# EAGLE design X15-Pi-Shield (EAGLE 9.6.2)

## Sheet 1 of 4
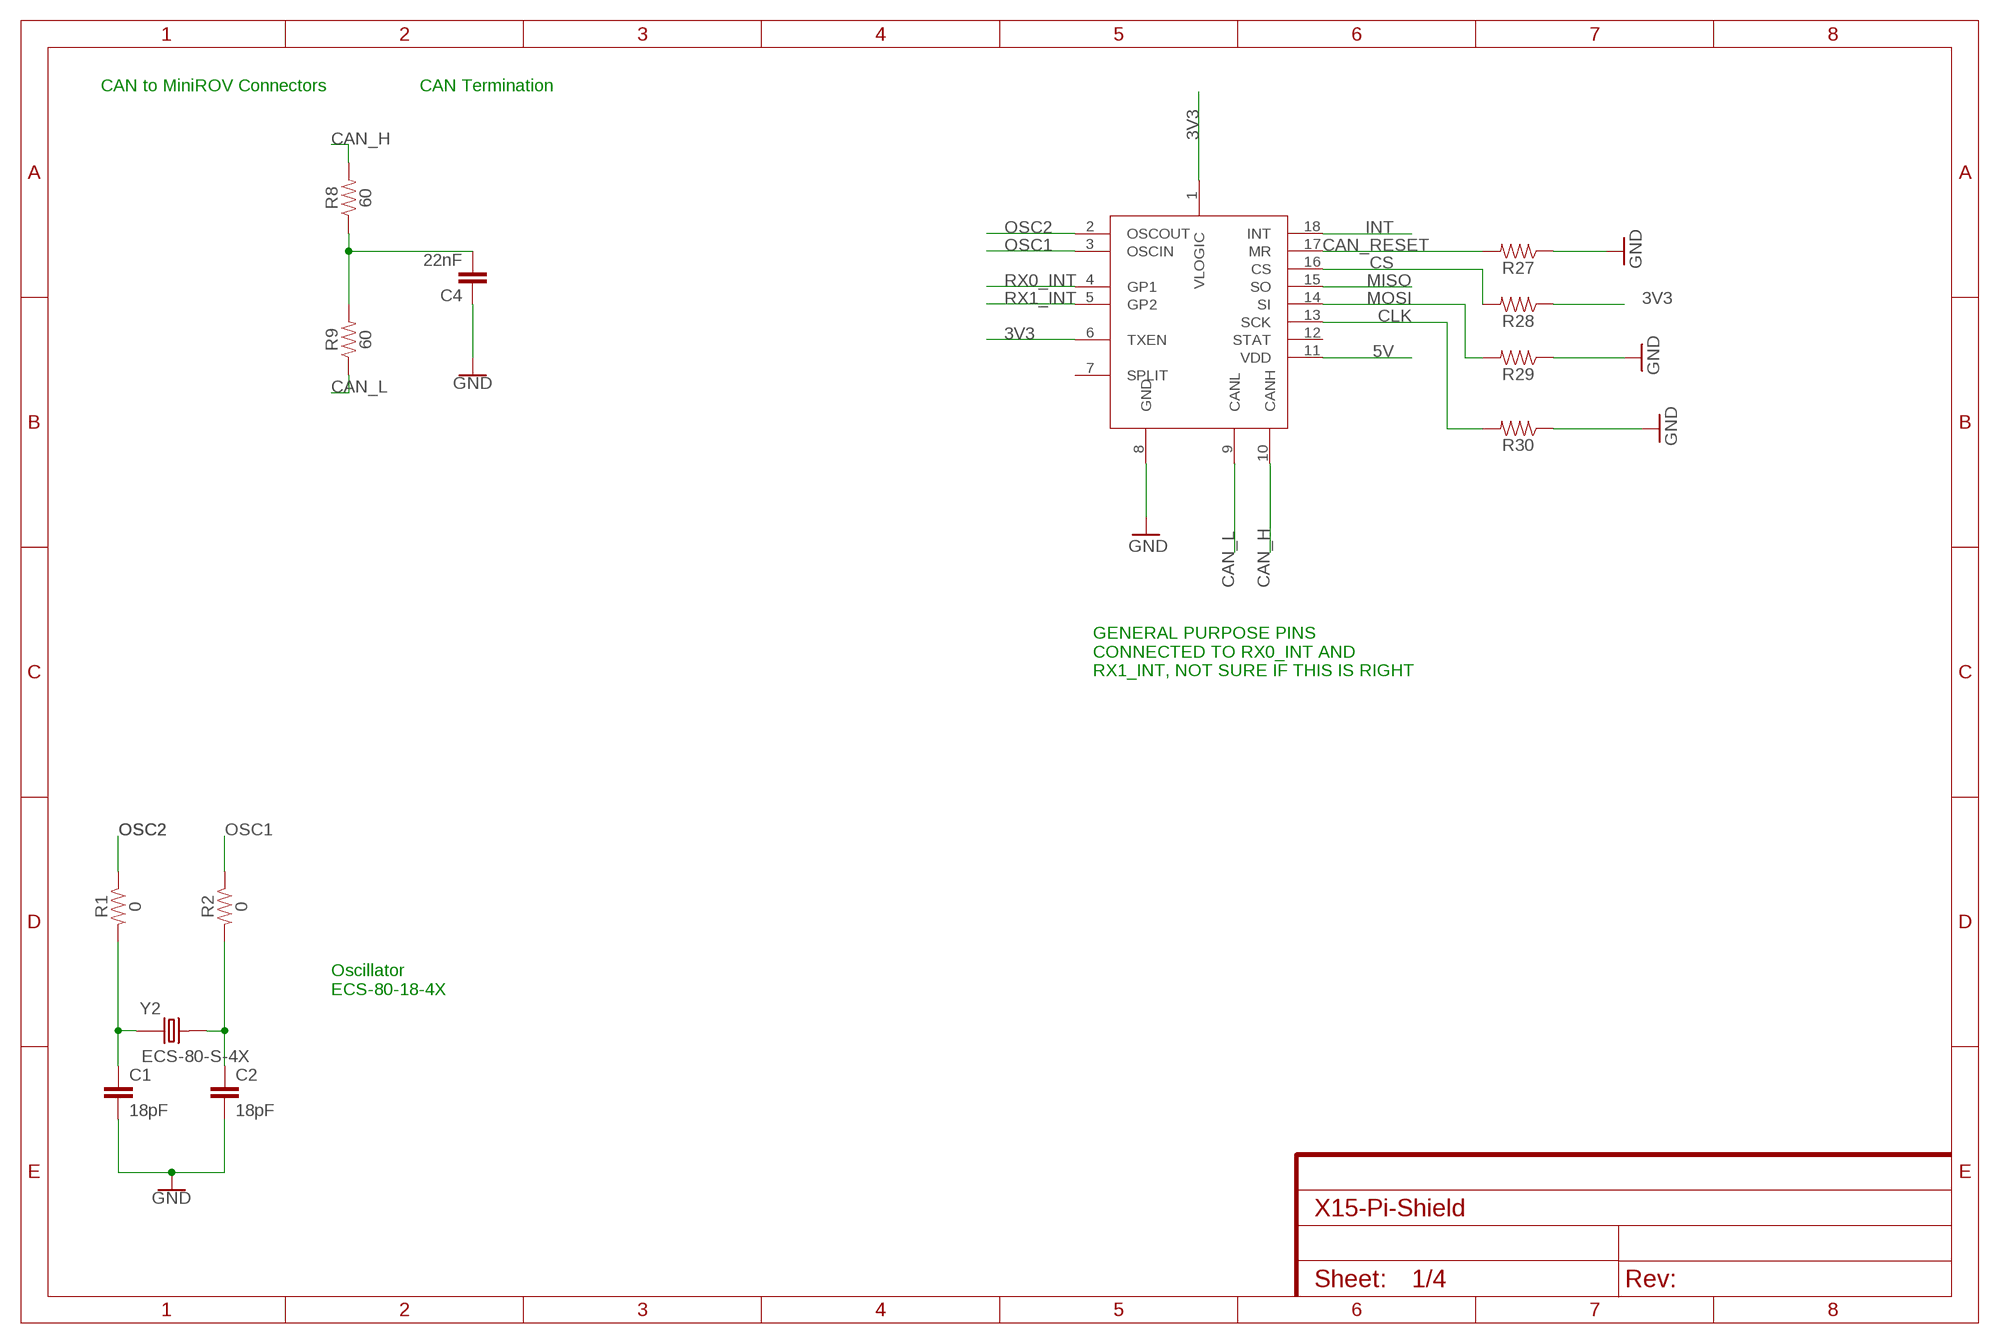
[diagram p0: schematic, sheet 1]

### Parts
C1  18pF  18PF-0603-50V-5%  [0603]
C2  18pF  18PF-0603-50V-5%  [0603]
C4  22nF  22NF/22,000PF-0603-50V-10%  [0603]
R1  0  RESISTOR0603  [0603]
R2  0  RESISTOR0603  [0603]
R8  60  RESISTOR0603  [0603]
R9  60  RESISTOR0603  [0603]
R27  50k  RESISTOR0603  [0603]
R28  50k  RESISTOR0603  [0603]
R29  50k  RESISTOR0603  [0603]
R30  50k  RESISTOR0603  [0603]
U$6  HI-3110  [SOIC-18]
Y2  ECS-80-S-4X  [XTAL_ECS-80-S-4X]

### Nets
3V3: R28.1 U$6.1(VLOGIC) U$6.6(TXEN) ; also sheet 2,3,4
5V: U$6.11(VDD) ; also sheet 2,3,4
CAN_H: R8.2 U$6.10(CANH) ; also sheet 2,4
CAN_L: R9.1 U$6.9(CANL) ; also sheet 2,4
CAN_RESET: R27.2 U$6.17(MR) ; also sheet 2
CLK: R30.2 U$6.13(SCK) ; also sheet 2
CS: R28.2 U$6.16(CS) ; also sheet 2
GND: C1.2 C2.2 C4.1 R27.1 R29.1 R30.1 U$6.8(GND) ; also sheet 2,3,4
INT: U$6.18(INT) ; also sheet 2
MISO: U$6.15(SO) ; also sheet 2
MOSI: R29.2 U$6.14(SI) ; also sheet 2
N$1: C1.1 R1.2 Y2.1
N$2: C2.1 R2.2 Y2.2
N$3: C4.2 R8.1 R9.2
OSC1: R2.1 U$6.3(OSCIN)
OSC2: R1.1 U$6.2(OSCOUT)
RX0_INT: U$6.4(GP1) ; also sheet 2
RX1_INT: U$6.5(GP2) ; also sheet 2
Unconnected: U$6.7(SPLIT) U$6.12(STAT)

### Notes on the sheet
- CAN to MiniROV Connectors | CAN Termination
- GENERAL PURPOSE PINS
  CONNECTED TO RX0_INT AND
  RX1_INT, NOT SURE IF THIS IS RIGHT
- Oscillator 
  ECS-80-18-4X

## Sheet 2 of 4
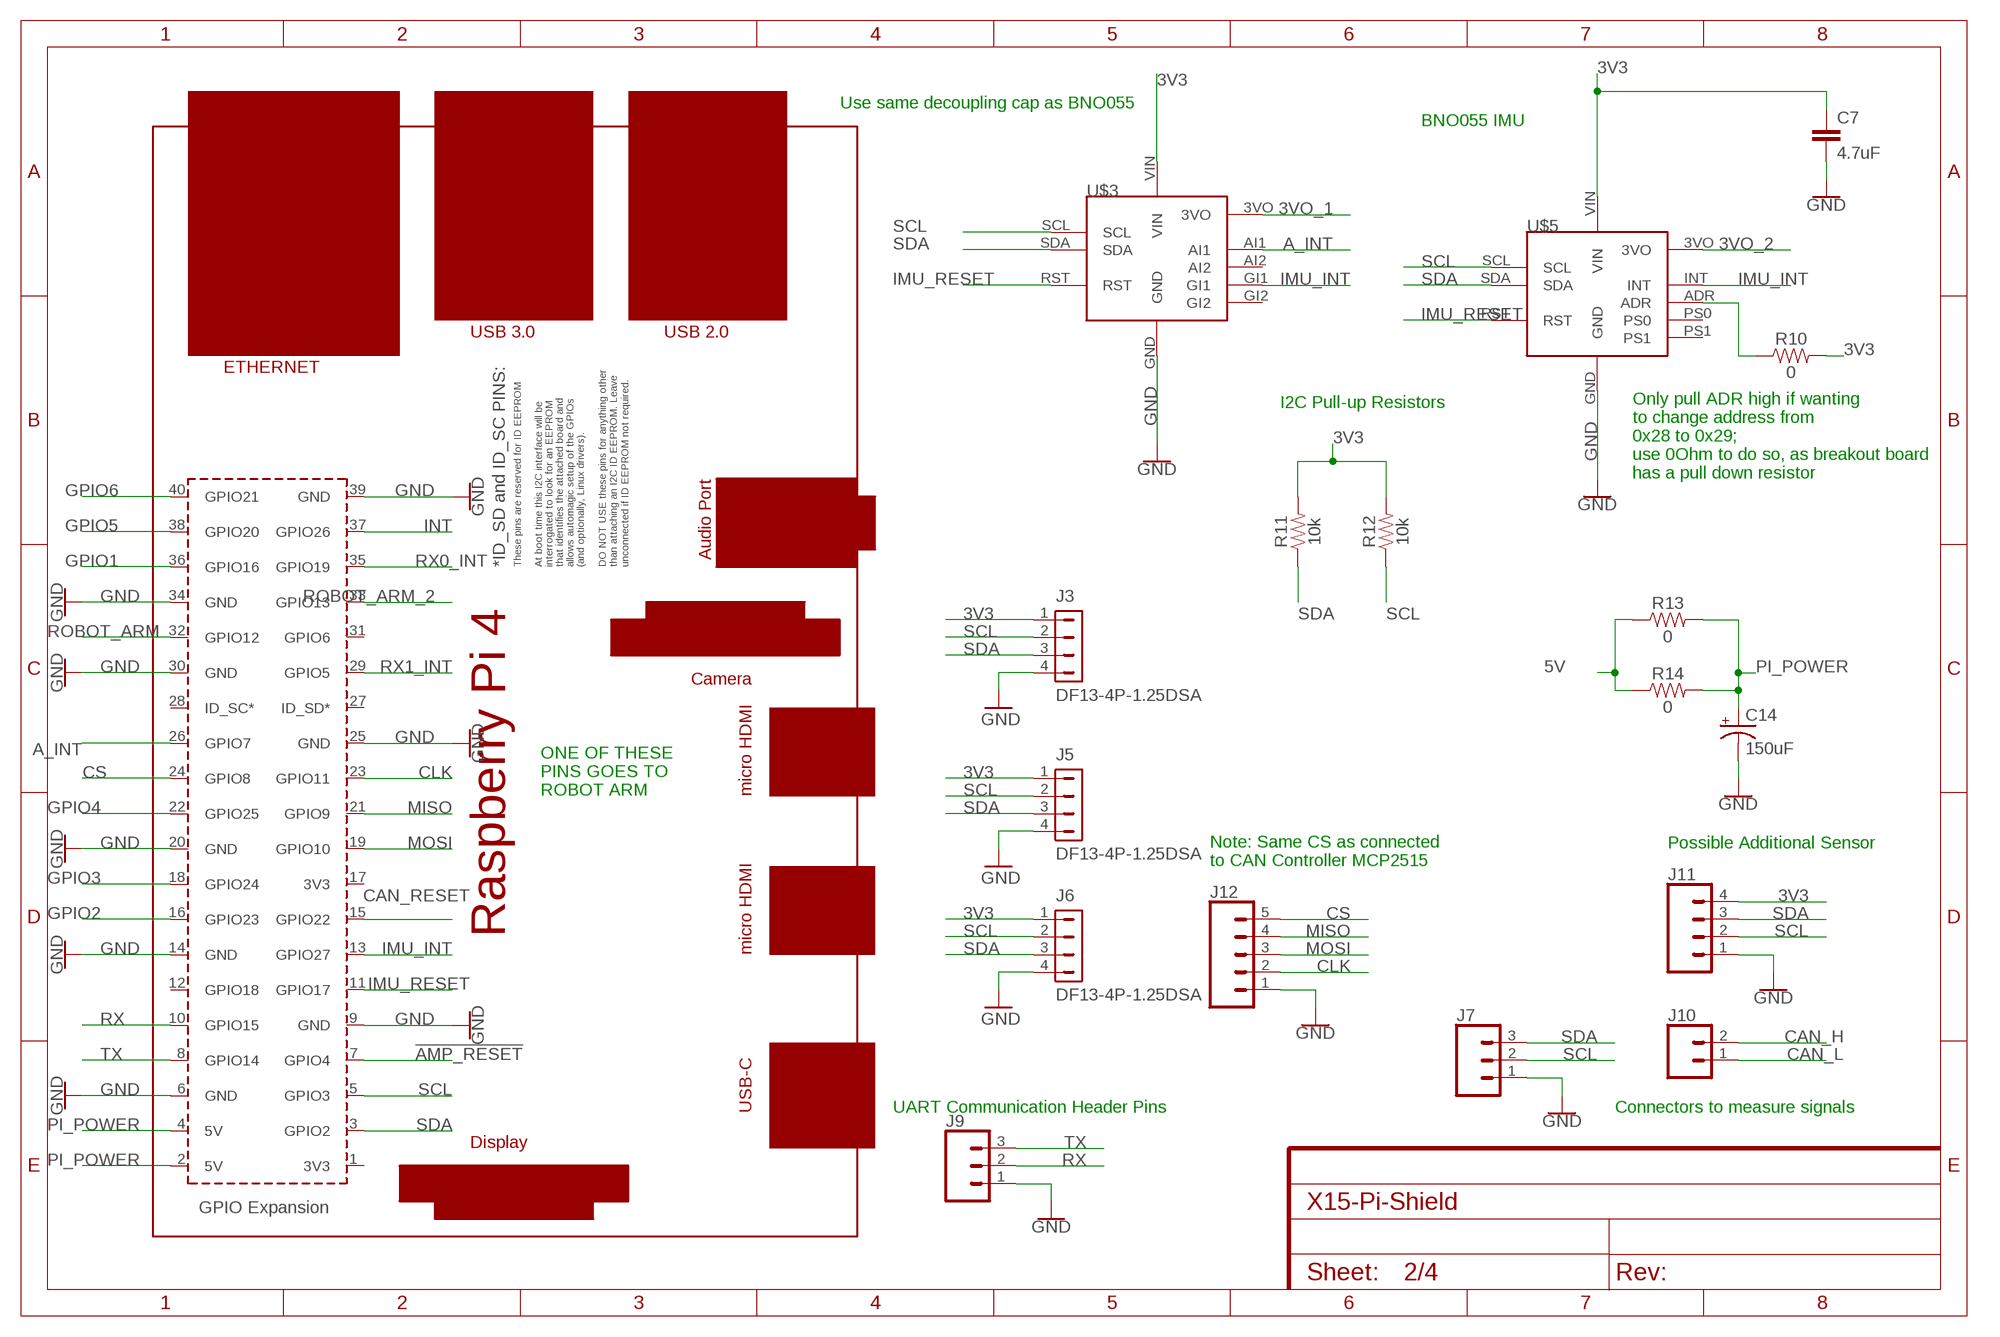
[diagram p1: schematic, sheet 2]

### Parts
C7  4.7uF  4.7UF0603  [0603]
C14  150uF  C-TANTALUM(10UF_150UF)  [2917(7343-31-METRIC)]
J3  DF13-4P-1.25DSA  [DF13-4P-1.25DSA]
J5  DF13-4P-1.25DSA  [DF13-4P-1.25DSA]
J6  DF13-4P-1.25DSA  [DF13-4P-1.25DSA]
J7  CONN_03  [1X03]
J9  CONN_03  [1X03]
J10  CONN_02  [1X02]
J11  CONN_04  [1X04]
J12  CONN_05  [1X05]
R10  0  RESISTOR0603  [0603]
R11  10k  RESISTOR0603  [0603]
R12  10k  RESISTOR0603  [0603]
R13  0  RESISTOR0603  [0603]
R14  0  RESISTOR0603  [0603]
U$3  ADAFRUIT-FXOS8700-FXAS21002  [ADAFRUIT-FXOS8700-FXAS21002]
U$4  RPI4  [RPI4]
U$5  ADAFRUIT-BNO055  [ADAFRUIT-BNO055]

### Nets
3V3: C7.1 J3.1 J5.1 J6.1 J11.4 R10.2 R11.2 R12.2 U$3.VIN U$5.VIN ; also sheet 1,3,4
3VO_1: U$3.3VO
3VO_2: U$5.3VO
5V: R13.1 R14.1 ; also sheet 1,3,4
!AMP_RESET: U$4.7(GPIO4) ; also sheet 3
A_INT: U$3.AI1 U$4.26(GPIO7)
CAN_H: J10.2 ; also sheet 1,4
CAN_L: J10.1 ; also sheet 1,4
CAN_RESET: U$4.15(GPIO22) ; also sheet 1
CLK: J12.2 U$4.23(GPIO11) ; also sheet 1
CS: J12.5 U$4.24(GPIO8) ; also sheet 1
GND: C7.2 C14.- J3.4 J5.4 J6.4 J7.1 J9.1 J11.1 J12.1 U$3.GND U$4.6(GND) U$4.9(GND) U$4.14(GND) U$4.20(GND) U$4.25(GND) U$4.30(GND) U$4.34(GND) U$4.39(GND) U$5.GND ; also sheet 1,3,4
GPIO1: U$4.36(GPIO16) ; also sheet 4
GPIO2: U$4.16(GPIO23) ; also sheet 4
GPIO3: U$4.18(GPIO24) ; also sheet 4
GPIO4: U$4.22(GPIO25) ; also sheet 4
GPIO5: U$4.38(GPIO20) ; also sheet 4
GPIO6: U$4.40(GPIO21) ; also sheet 4
IMU_INT: U$3.GI1 U$4.13(GPIO27) U$5.INT
IMU_RESET: U$3.RST U$4.11(GPIO17) U$5.RST
INT: U$4.37(GPIO26) ; also sheet 1
MISO: J12.4 U$4.21(GPIO9) ; also sheet 1
MOSI: J12.3 U$4.19(GPIO10) ; also sheet 1
N$8: R10.1 U$5.ADR
PI_POWER: C14.+ R13.2 R14.2 U$4.2(5V) U$4.4(5V)
ROBOT_ARM: U$4.32(GPIO12) ; also sheet 4
ROBOT_ARM_2: U$4.33(GPIO13) ; also sheet 4
RX: J9.2 U$4.10(GPIO15)
RX0_INT: U$4.35(GPIO19) ; also sheet 1
RX1_INT: U$4.29(GPIO5) ; also sheet 1
SCL: J3.2 J5.2 J6.2 J7.2 J11.2 R12.1 U$3.SCL U$4.5(GPIO3) U$5.SCL ; also sheet 3
SDA: J3.3 J5.3 J6.3 J7.3 J11.3 R11.1 U$3.SDA U$4.3(GPIO2) U$5.SDA ; also sheet 3
TX: J9.3 U$4.8(GPIO14)
Unconnected: U$3.AI2 U$3.GI2 U$4.1(3V3) U$4.12(GPIO18) U$4.17(3V3) U$4.27(ID_SD*) U$4.28(ID_SC*) U$4.31(GPIO6) U$5.PS0 U$5.PS1

### Notes on the sheet
- Use same decoupling cap as BNO055
- BNO055 IMU
- I2C Pull-up Resistors
- Only pull ADR high if wanting
  to change address from 
  0x28 to 0x29;
  use 0Ohm to do so, as breakout board
  has a pull down resistor
- ONE OF THESE
  PINS GOES TO
  ROBOT ARM
- Possible Additional Sensor
- Note: Same CS as connected 
  to CAN Controller MCP2515
- UART Communication Header Pins | Connectors to measure signals

## Sheet 3 of 4
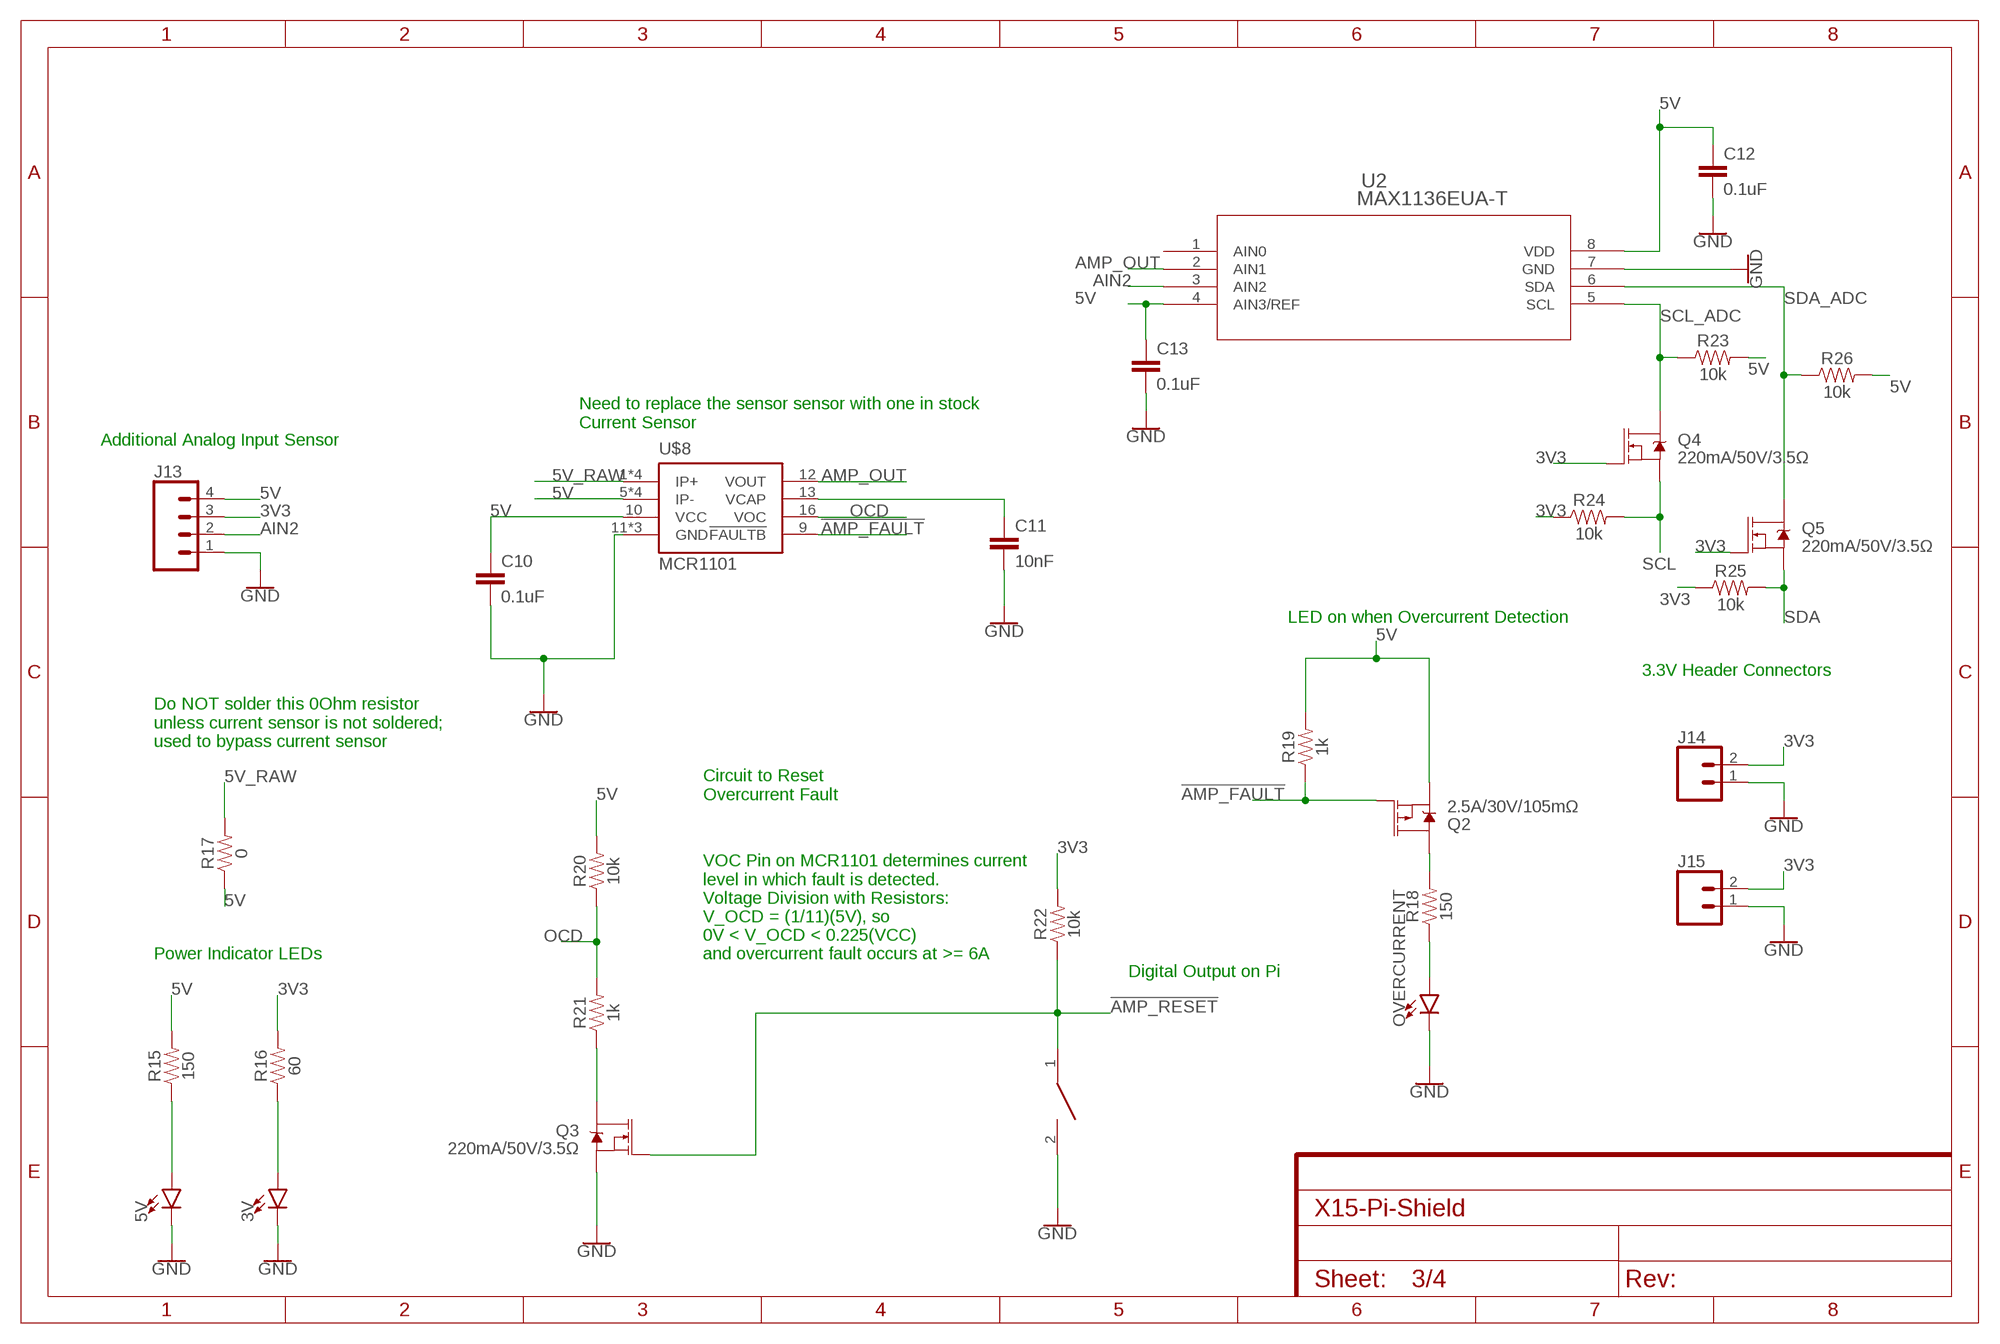
[diagram p2: schematic, sheet 3]

### Parts
3V  LED0603  [LED-0603]
5V  LED0603  [LED-0603]
C10  0.1uF  0.1UF-0603-25V-(+80/-20%)  [0603]
C11  10nF  10NF-0603-50V-10%  [0603]
C12  0.1uF  0.1UF-0603-25V-(+80/-20%)  [0603]
C13  0.1uF  0.1UF-0603-25V-(+80/-20%)  [0603]
J13  CONN_04  [1X04]
J14  CONN_02  [1X02]
J15  CONN_02  [1X02]
OVERCURRENT  LED0603  [LED-0603]
Q2  2.5A/30V/105mΩ  MOSFET_PCH-DMG2307L  [SOT23-3]
Q3  220mA/50V/3.5Ω  MOSFET-NCH-BSS138  [SOT23-3]
Q4  220mA/50V/3.5Ω  MOSFET-NCH-BSS138  [SOT23-3]
Q5  220mA/50V/3.5Ω  MOSFET-NCH-BSS138  [SOT23-3]
R15  150  RESISTOR0603  [0603]
R16  60  RESISTOR0603  [0603]
R17  0  RESISTOR0603  [0603]
R18  150  RESISTOR0603  [0603]
R19  1k  RESISTOR0603  [0603]
R20  10k  RESISTOR0603  [0603]
R21  1k  RESISTOR0603  [0603]
R22  10k  RESISTOR0603  [0603]
R23  10k  RESISTOR0603  [0603]
R24  10k  RESISTOR0603  [0603]
R25  10k  RESISTOR0603  [0603]
R26  10k  RESISTOR0603  [0603]
U2  MAX1136EUA-T  [21-0036K]
U$7  DISCRETECOMPONENTS_SWITCH  [DISCRETECOMPONENTS_SW_2512]
U$8  MCR1101  [SOIC-16]

### Nets
3V3: J13.3 J14.2 J15.2 Q4.1(G) Q5.1(G) R16.2 R22.2 R24.1 R25.1 ; also sheet 1,2,4
5V: C10.1 C12.1 C13.1 J13.4 Q2.2(S) R15.2 R17.1 R19.2 R20.2 R23.2 R26.2 U2.4(AIN3/REF) U2.8(VDD) U$8.5(IP-) U$8.6(IP-) U$8.7(IP-) U$8.8(IP-) U$8.10(VCC) ; also sheet 1,2,4
5V_RAW: R17.2 U$8.1(IP+) U$8.2(IP+) U$8.3(IP+) U$8.4(IP+)
!AMP_FAULT: Q2.1(G) R19.1 U$8.9(!FAULTB)
!AMP_RESET: Q3.1(G) R22.1 U$7.1 ; also sheet 2
AIN2: J13.2 U2.3(AIN2)
AMP_OUT: U2.2(AIN1) U$8.12(VOUT)
GND: 3V.C 5V.C C10.2 C11.2 C12.2 C13.2 J13.1 J14.1 J15.1 OVERCURRENT.C Q3.2(S) U2.7(GND) U$7.2 U$8.11(GND) U$8.14(GND) U$8.15(GND) ; also sheet 1,2,4
N$7: 5V.A R15.1
N$9: 3V.A R16.1
N$11: C11.1 U$8.13(VCAP)
N$12: Q2.3(D) R18.2
N$13: OVERCURRENT.A R18.1
N$14: Q3.3(D) R21.1
OCD: R20.1 R21.2 U$8.16(VOC)
SCL: Q4.2(S) R24.2 ; also sheet 2
SCL_ADC: Q4.3(D) R23.1 U2.5(SCL)
SDA: Q5.2(S) R25.2 ; also sheet 2
SDA_ADC: Q5.3(D) R26.1 U2.6(SDA)
Unconnected: U2.1(AIN0)

### Notes on the sheet
- Need to replace the sensor sensor with one in stock
  Current Sensor
- Additional Analog Input Sensor
- LED on when Overcurrent Detection
- 3.3V Header Connectors
- Do NOT solder this 0Ohm resistor
  unless current sensor is not soldered;
  used to bypass current sensor
- Circuit to Reset
  Overcurrent Fault
- Power Indicator LEDs
- VOC Pin on MCR1101 determines current 
  level in which fault is detected.
  Voltage Division with Resistors:
  V_OCD = (1/11)(5V), so 
  0V < V_OCD < 0.225(VCC) 
  and overcurrent fault occurs at >= 6A
- Digital Output on Pi

## Sheet 4 of 4
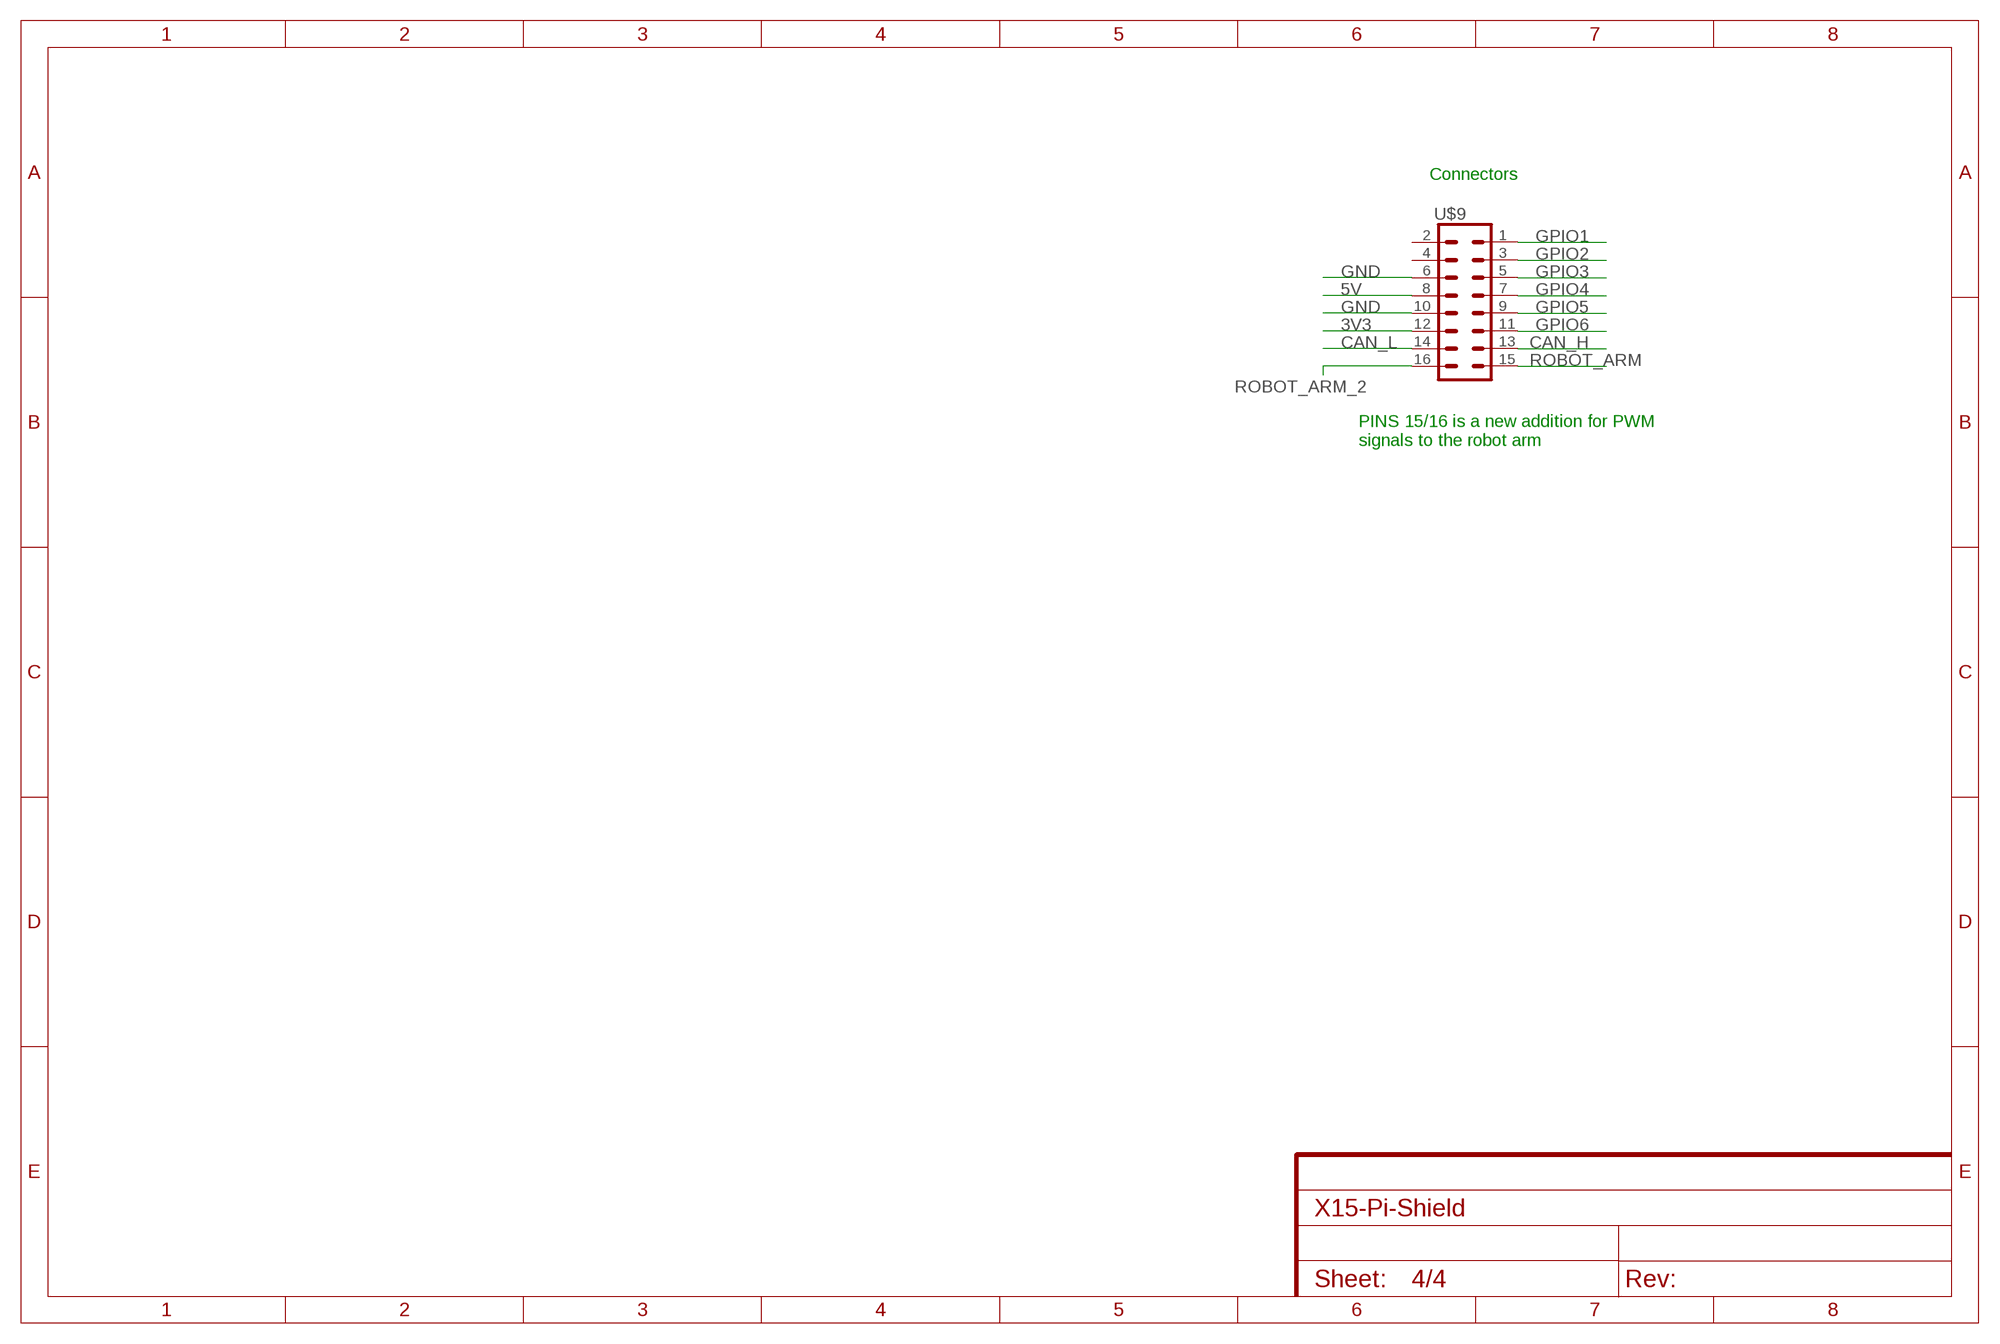
[diagram p3: schematic, sheet 4]

### Parts
U$9  8X_CONN  [IPL7X2]

### Nets
3V3: U$9.12 ; also sheet 1,2,3
5V: U$9.8 ; also sheet 1,2,3
CAN_H: U$9.13 ; also sheet 1,2
CAN_L: U$9.14 ; also sheet 1,2
GND: U$9.6 U$9.10 ; also sheet 1,2,3
GPIO1: U$9.1 ; also sheet 2
GPIO2: U$9.3 ; also sheet 2
GPIO3: U$9.5 ; also sheet 2
GPIO4: U$9.7 ; also sheet 2
GPIO5: U$9.9 ; also sheet 2
GPIO6: U$9.11 ; also sheet 2
ROBOT_ARM: U$9.15 ; also sheet 2
ROBOT_ARM_2: U$9.16 ; also sheet 2
Unconnected: U$9.2 U$9.4

### Notes on the sheet
- Connectors
- PINS 15/16 is a new addition for PWM
  signals to the robot arm

## Library data of the parts
3V 5V OVERCURRENT = SparkFun-LED:LED: LED (Generic) Standard schematic elements and footprints for 5mm, 3mm, 1206, and 0603 sized LEDs. Generic LEDs with no color specified.
C1 C2 = SparkFun-Capacitors:18PF: 18pF ceramic capacitors A capacitor is a passive two-terminal electrical component used to store electrical energy temporarily in an electric field.; PROD_ID: CAP-08267
C4 = SparkFun-Capacitors:22NF/22,000PF: 0.022uF/22nF/22,000pF ceramic capacitors A capacitor is a passive two-terminal electrical component used to store electrical energy temporarily in an electric field.; PROD_ID: CAP-07885
C7 = SparkFun-Capacitors:4.7UF: 4.7µF ceramic capacitors A capacitor is a passive two-terminal electrical component used to store electrical energy temporarily in an electric field.; PROD_ID: CAP-08280
C10 C12 C13 = SparkFun-Capacitors:0.1UF: 0.1µF ceramic capacitors A capacitor is a passive two-terminal electrical component used to store electrical energy temporarily in an electric field.; PROD_ID: CAP-00810
C11 = SparkFun-Capacitors:10NF: 0.01uF/10nF/10,000pF ceramic capacitors A capacitor is a passive two-terminal electrical component used to store electrical energy temporarily in an electric field. CAP-09321; PROD_ID: CAP-00867
C14 = X15-Pi-Shield-Parts:C-TANTALUM(10UF_150UF)
J3 J5 J6 = X15-Pi-Shield-Parts:DF13-4P-1.25: DF13-4P 1.25mm Pitch Miniature Crimping Connector.
J7 J9 = SparkFun-Connectors:CONN_03: Multi connection point. Often used as Generic Header-pin footprint for 0.1 inch spaced/style header connections On any of the 0.1 inch spaced packages, you can populate with these: Break Away Headers - Straight <https://www.sparkfun.com/products/116> (PRT-00116) Break Away Male Headers - Right Angle <https://www.sparkfun.com/products/553> (PRT-00553) Female Headers <https://www.sparkfun.com/products/115> (PRT-00115) Break Away Headers - Machine Pin <https://www.sparkfun.com/products/117> (PRT-00117) Break Away Female Headers - Swiss Machine Pin <https://www.sparkfun.com/products/743> (PRT-00743) Stackable Header - 3 Pin (Female, 0.1") <https://www.sparkfun.com/products/13875> (PRT-13875) For SCREWTERMINALS and SPRING TERMINALS visit here: Screw Terimnals on SparkFun.com <https://www.sparkfun.com/search/results?term=Screw+Terminals> (5mm/3.5mm/2.54mm spacing) This device is also useful as a general connection point to wire up your design to another part of your project. Our various solder wires solder well into these plated through hole pads. Hook-Up Wire - Assortment (Stranded, 22 AWG) <https://www.sparkfun.com/products/11375> (PRT-11375) Hook-Up Wire - Assortment (Solid Core, 22 AWG) <https://www.sparkfun.com/products/11367> (PRT-11367) View the entire wire category on our website here <https://www.sparkfun.com/categories/141> Special notes: Molex polarized connector foot print use with SKU : PRT-08232 with associated crimp pins and housings.
J10 J14 J15 = SparkFun-Connectors:CONN_02: Multi connection point. Often used as Generic Header-pin footprint for 0.1 inch spaced/style header connections On any of the 0.1 inch spaced packages, you can populate with these: Break Away Headers - Straight <https://www.sparkfun.com/products/116> (PRT-00116) Break Away Male Headers - Right Angle <https://www.sparkfun.com/products/553> (PRT-00553) Female Headers <https://www.sparkfun.com/products/115> (PRT-00115) Break Away Headers - Machine Pin <https://www.sparkfun.com/products/117> (PRT-00117) Break Away Female Headers - Swiss Machine Pin <https://www.sparkfun.com/products/743> (PRT-00743) For SCREWTERMINALS and SPRING TERMINALS visit here: Screw Terimnals on SparkFun.com <https://www.sparkfun.com/search/results?term=Screw+Terminals> (5mm/3.5mm/2.54mm spacing) This device is also useful as a general connection point to wire up your design to another part of your project. Our various solder wires solder well into these plated through hole pads. Hook-Up Wire - Assortment (Stranded, 22 AWG) <https://www.sparkfun.com/products/11375> (PRT-11375) Hook-Up Wire - Assortment (Solid Core, 22 AWG) <https://www.sparkfun.com/products/11367> (PRT-11367) View the entire wire category on our website here <https://www.sparkfun.com/categories/141> Special notes: Molex polarized connector foot print use with: PRT-08233 with associated crimp pins and housings. 2.54_SCREWTERM for use with PRT-10571. 3.5mm Screw Terminal footprints for PRT-08084 5mm Screw Terminal footprints for use with PRT-08432
J11 J13 = SparkFun-Connectors:CONN_04: Multi connection point. Often used as Generic Header-pin footprint for 0.1 inch spaced/style header connections On any of the 0.1 inch spaced packages, you can populate with these: Break Away Headers - Straight <https://www.sparkfun.com/products/116> (PRT-00116) Break Away Male Headers - Right Angle <https://www.sparkfun.com/products/553> (PRT-00553) Female Headers <https://www.sparkfun.com/products/115> (PRT-00115) Break Away Headers - Machine Pin <https://www.sparkfun.com/products/117> (PRT-00117) Break Away Female Headers - Swiss Machine Pin <https://www.sparkfun.com/products/743> (PRT-00743) For SCREWTERMINALS and SPRING TERMINALS visit here: Screw Terimnals on SparkFun.com <https://www.sparkfun.com/search/results?term=Screw+Terminals> (5mm/3.5mm/2.54mm spacing) This device is also useful as a general connection point to wire up your design to another part of your project. Our various solder wires solder well into these plated through hole pads. Hook-Up Wire - Assortment (Stranded, 22 AWG) <https://www.sparkfun.com/products/11375> (PRT-11375) Hook-Up Wire - Assortment (Solid Core, 22 AWG) <https://www.sparkfun.com/products/11367> (PRT-11367) View the entire wire category on our website here <https://www.sparkfun.com/categories/141> Special notes: Molex polarized connector foot print use with SKU : PRT-08231 with associated crimp pins and housings. 1MM SMD Version SKU: PRT-10208; PROD_ID: CONN-09696
J12 = SparkFun-Connectors:CONN_05: Multi connection point. Often used as Generic Header-pin footprint for 0.1 inch spaced/style header connections On any of the 0.1 inch spaced packages, you can populate with these: Break Away Headers - Straight <https://www.sparkfun.com/products/116> (PRT-00116) Break Away Male Headers - Right Angle <https://www.sparkfun.com/products/553> (PRT-00553) Female Headers <https://www.sparkfun.com/products/115> (PRT-00115) Break Away Headers - Machine Pin <https://www.sparkfun.com/products/117> (PRT-00117) Break Away Female Headers - Swiss Machine Pin <https://www.sparkfun.com/products/743> (PRT-00743) For SCREWTERMINALS and SPRING TERMINALS visit here: Screw Terimnals on SparkFun.com <https://www.sparkfun.com/search/results?term=Screw+Terminals> (5mm/3.5mm/2.54mm spacing) This device is also useful as a general connection point to wire up your design to another part of your project. Our various solder wires solder well into these plated through hole pads. Hook-Up Wire - Assortment (Stranded, 22 AWG) <https://www.sparkfun.com/products/11375> (PRT-11375) Hook-Up Wire - Assortment (Solid Core, 22 AWG) <https://www.sparkfun.com/products/11367> (PRT-11367) View the entire wire category on our website here <https://www.sparkfun.com/categories/141> Special notes: Molex polarized connector foot print use with SKU : PRT-08231 with associated crimp pins and housings. 1MM SMD Version SKU: PRT-10208
Q2 = SparkFun-DiscreteSemi:MOSFET_PCH: P-channel MOSFETs Voltage controlled devices that allow control of high current outputs. SparkFun Products: SparkFun ESP32 Thing <https://www.sparkfun.com/products/13907> SparkFun ESP8266 Thing <https://www.sparkfun.com/products/13231>; PROD_ID: TRANS-11308
Q3-Q5 = SparkFun-DiscreteSemi:MOSFET-NCH: N-channel MOSFETs Voltage controlled devices that allow control of high current outputs. SparkFun Products: SparkFun OpenScale <https://www.sparkfun.com/products/13261> SparkFun Digital Sandbox <https://www.sparkfun.com/products/12651> SparkFun Monster Moto Shield <https://www.sparkfun.com/products/10182> SparkFun MOSFET Power Controller <https://www.sparkfun.com/products/11214>; PROD_ID: TRANS-00830
R1 R2 R8-R30 = SparkFun-Resistors:RESISTOR: Generic Resistor Package
U2 = X15-Pi-Shield-Parts:MAX1136EUA-T; DESCRIPTION: 2.7V to 3.6V and 4.5V to 5.5V, Low-Power, 4-/12-Channel, 2-Wire Serial 10-Bit AD; DIGI-KEY_PART_NUMBER: MAX1136EUA+-ND; DIGI-KEY_PURCHASE_URL: https://www.digikey.com/product-detail/en/maxim-integrated/MAX1136EUA-/MAX1136EUA--ND/1159953?utm_source=snapeda&utm_medium=aggregator&utm_campaign=symbol; MF: Maxim Integrated; MP: MAX1136EUA+; PACKAGE: MSOP-8 Maxim Integrated
U$3 = X15-Pi-Shield-Parts:ADAFRUIT-FXOS8700-FXAS21002
U$4 = X15-Pi-Shield-Parts:RPI4
U$5 = X15-Pi-Shield-Parts:ADAFRUIT-BNO055
U$6 = X15-Pi-Shield-Parts:HI-3110
U$7 = X15-Pi-Shield-Parts:DISCRETECOMPONENTS_SWITCH: TE Connectivity FSM2JMTR Switch
U$8 = X15-Pi-Shield-Parts:MCR1101
U$9 = X15-Pi-Shield-Parts:8X_CONN; SPICEPREFIX: X
Y2 = X15-Pi-Shield-Parts:ECS-80-S-4X: CRYSTAL T/H; DESCRIPTION: Crystal 8MHz Series 2-Pin HC-49/U; DIGI-KEY_PART_NUMBER: X1057-ND; DIGI-KEY_PURCHASE_URL: https://www.digikey.com/product-detail/en/ecs-inc/ECS-80-S-4X/X1057-ND/827549?utm_source=snapeda&utm_medium=aggregator&utm_campaign=symbol; MF: ECS International; MP: ECS-80-S-4X; PACKAGE: HC-49/US ECS International

## Board
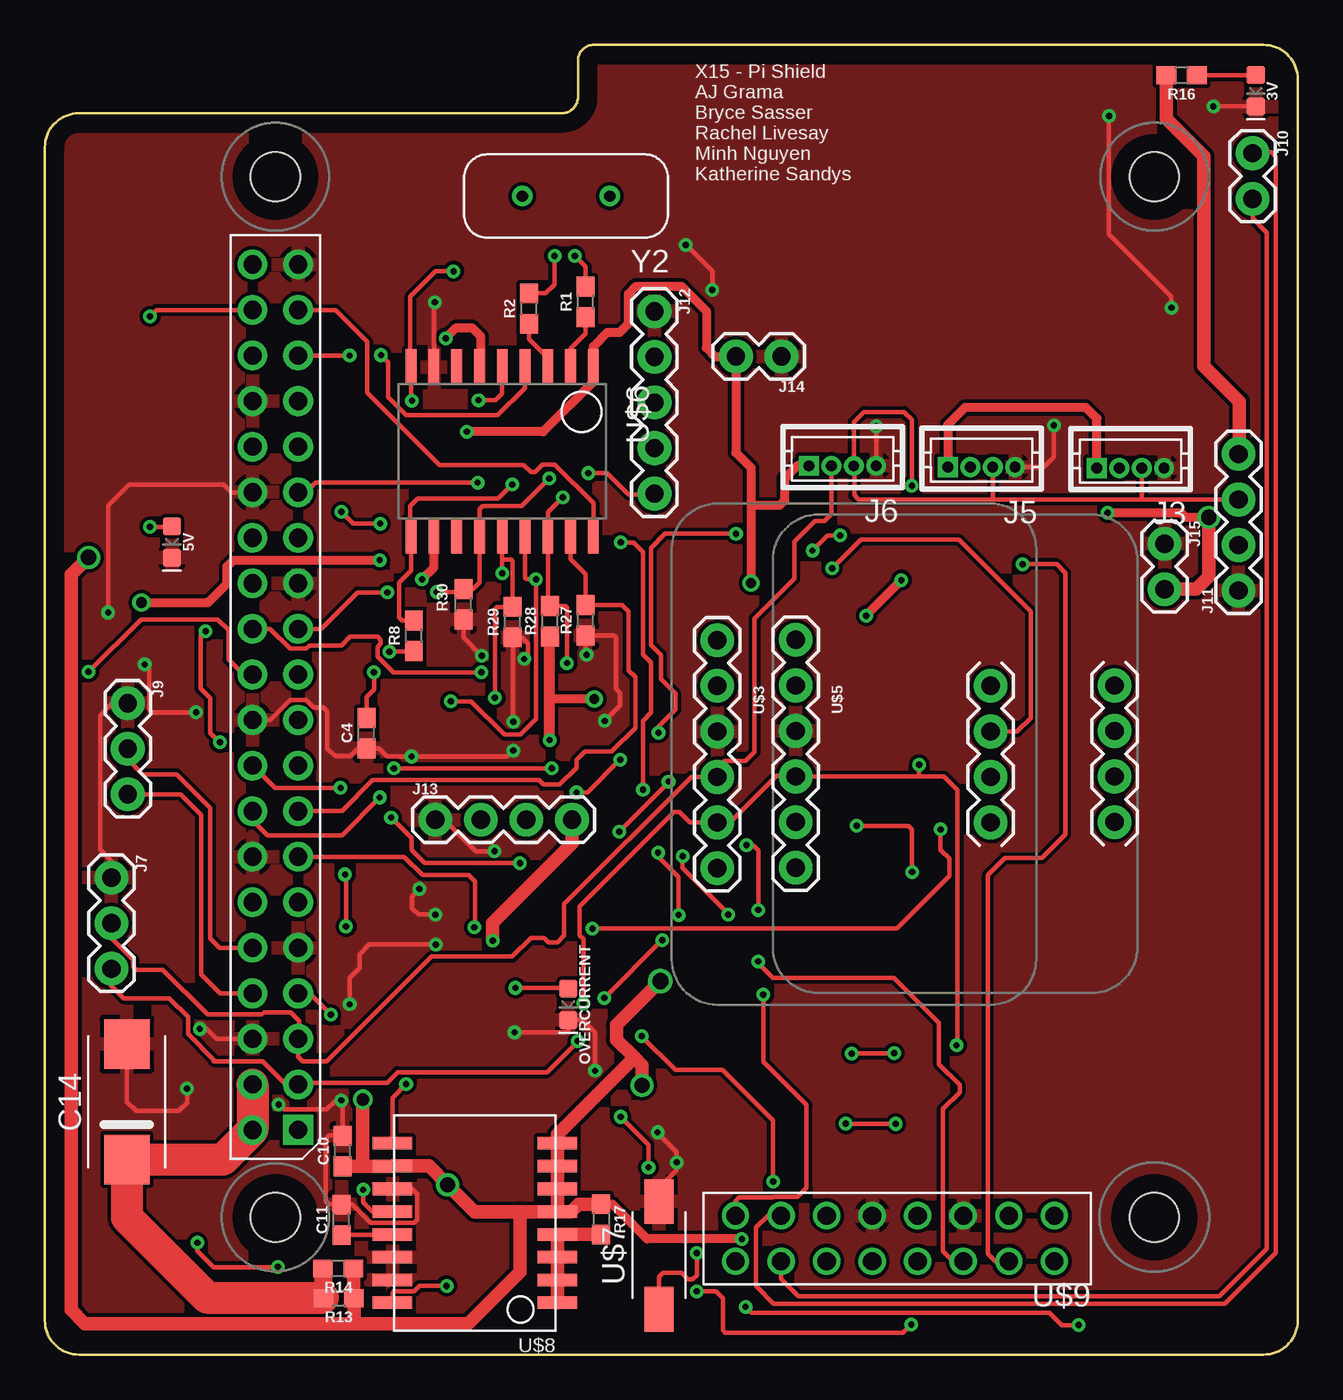
[diagram p4: board, top side]
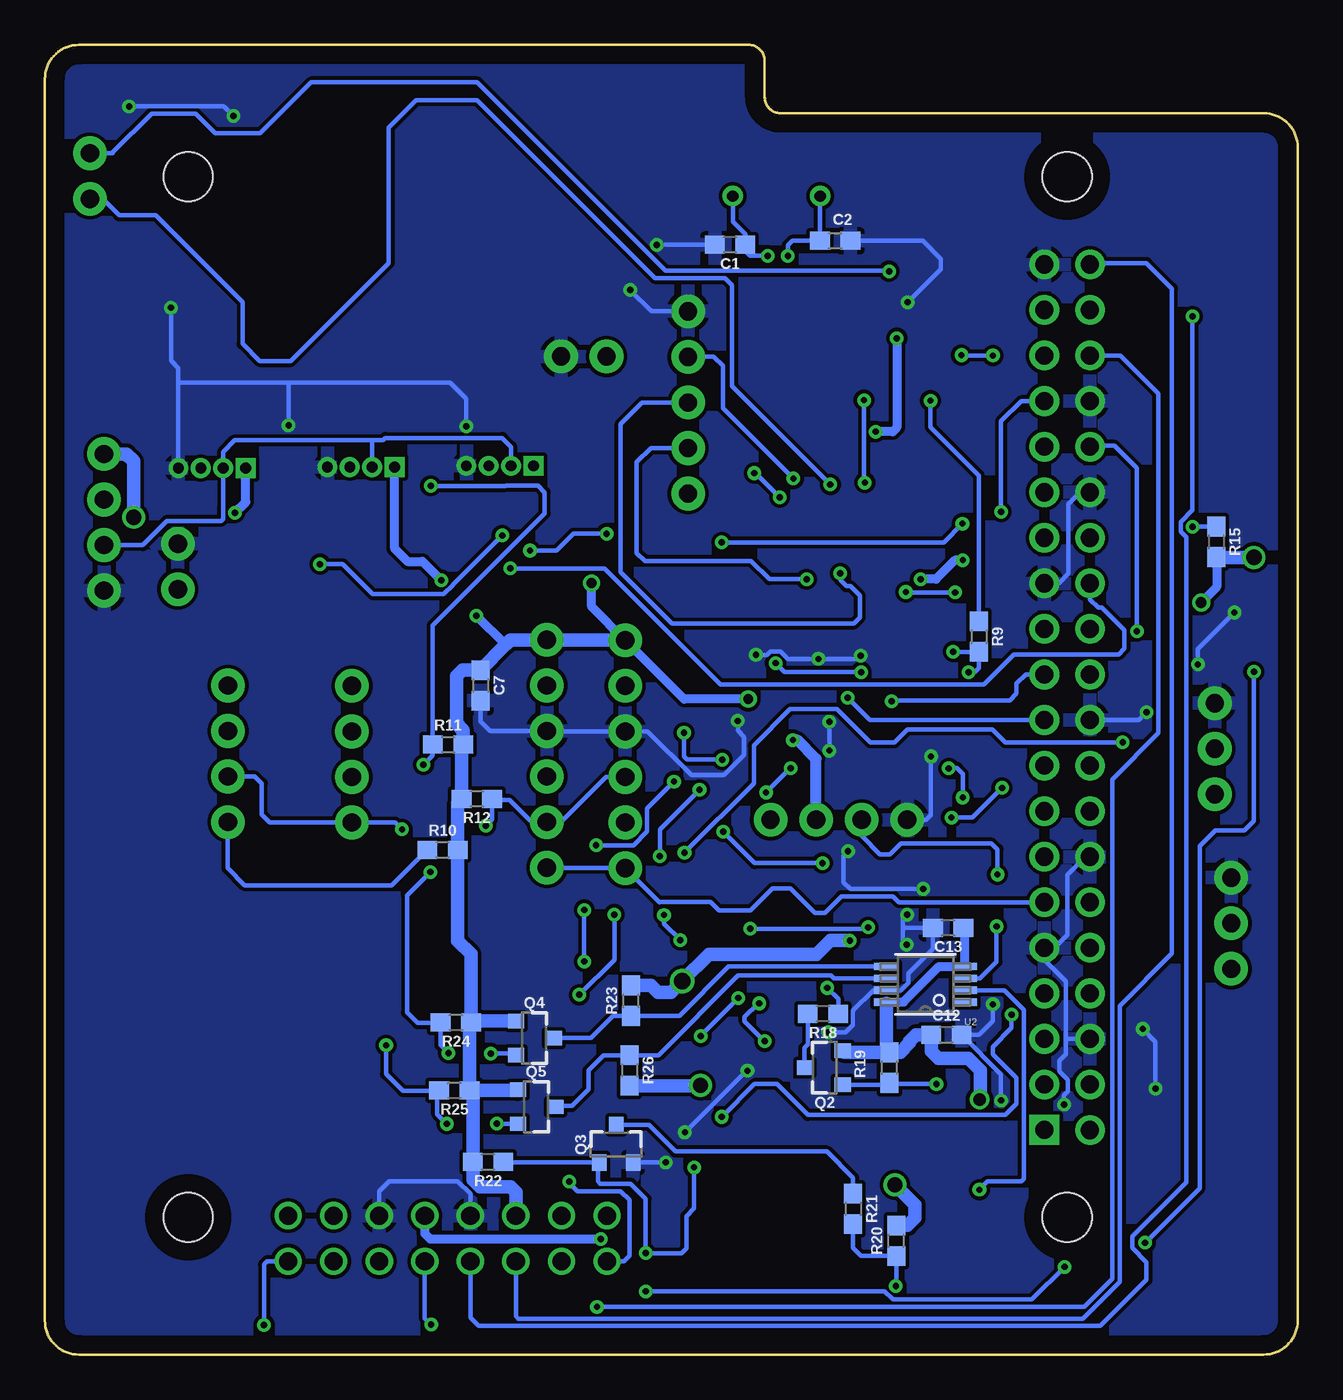
[diagram p5: board, bottom side, seen from below]

Size 69.85 x 73.03 mm. Coordinates in mm from the lower left corner, seen from the top.
Outline: 1.9,69.22 28.83,69.22 arc90 29.72,70.1 29.72,72.14 arc-90 30.61,73.03 67.94,73.03 arc-90 69.85,71.12 69.85,1.91 arc-90 67.94,0 1.9,0 arc-90 0,1.91 0,67.31 arc-90 1.9,69.22
Copper layers (1*16): Top 0.035mm / dielectric 1.5mm / Bottom 0.035mm
Design rules "477": minimum track width 6mil, minimum drill 0.35mm, track to track 6mil, track to pad 6mil, pad to pad 6mil, via to via 6mil, smd to smd 6mil, copper to edge 40mil, drill to drill 6mil, minimum pad ring 10mil, minimum via ring 8mil, stop-mask expansion 4mil, vias tented up to drill 0mil, thermal gap 10mil

### Footprints (pad centres in the part's own frame; a part is rotated, then mirrored left to right if it is on the bottom)
LED-0603 = smd 1 x 1: A -0.877,0; C 0.877,0
0603 = smd 1.1 x 1: 1 -0.85,0; 2 0.85,0
2917(7343-31-METRIC) = smd 2.77 x 2.55: + -3.22,0; - 3.22,0
DF13-4P-1.25DSA = drill 0.6 pad 1.016 square: 1 1.875,0 | drill 0.6 pad 1.016: 2 0.625,0; 3 -0.625,0; 4 -1.875,0
1X03 = drill 1.016 pad 1.88: 1 0,0; 2 2.54,0; 3 5.08,0
1X02 = drill 1.016 pad 1.88: 1 0,0; 2 2.54,0
1X04 = drill 1.016 pad 1.88: 1 0,0; 2 2.54,0; 3 5.08,0; 4 7.62,0
1X05 = drill 1.016 pad 1.88: 1 0,0; 2 2.54,0; 3 5.08,0; 4 7.62,0; 5 10.16,0
SOT23-3 = smd 0.8 x 0.9: 1 -0.95,-1; 2 0.95,-1; 3 0,1.1
21-0036K = smd 1.372 x 0.406: 1 -2.184,0.991; 2 -2.184,0.33; 3 -2.184,-0.33; 4 -2.184,-0.991; 5 2.184,-0.991; 6 2.184,-0.33; 7 2.184,0.33; 8 2.184,0.991
ADAFRUIT-FXOS8700-FXAS21002 = drill 1.016 pad 1.88: 3VO 10.16,2.54; AI1 12.7,17.78; AI2 10.16,17.78; GI1 17.78,17.78; GI2 15.24,17.78; GND 12.7,2.54; RST 20.32,2.54; SCL 15.24,2.54; SDA 17.78,2.54; VIN 7.62,2.54
RPI4 = drill 1.016 pad 1.651 square: 1 8.37,51.23 | drill 1.016 pad 1.651: 2 8.357,53.772; 3 10.897,51.232; 4 10.897,53.772; 5 13.437,51.232; 6 13.437,53.772; 7 15.977,51.232; 8 15.977,53.772; 9 18.517,51.232; 10 18.517,53.772; 11 21.057,51.232; 12 21.057,53.772; 13 23.597,51.232; 14 23.597,53.772; 15 26.137,51.232; 16 26.137,53.772; 17 28.677,51.232; 18 28.677,53.772; 19 31.217,51.232; 20 31.217,53.772; 21 33.757,51.232; 22 33.757,53.772; 23 36.297,51.232; 24 36.297,53.772; 25 38.837,51.232; 26 38.837,53.772; 27 41.377,51.232; 28 41.377,53.772; 29 43.917,51.232; 30 43.917,53.772; 31 46.457,51.232; 32 46.457,53.772; 33 48.997,51.232; 34 48.997,53.772; 35 51.537,51.232; 36 51.537,53.772; 37 54.077,51.232; 38 54.077,53.772; 39 56.617,51.232; 40 56.617,53.772 | hole 2.75: 3.5,3.5; 61.5,3.5; 3.5,52.5; 61.5,52.5
ADAFRUIT-BNO055 = drill 1.016 pad 1.88: 3VO 9.525,1.27; ADR 17.145,19.05; GND 12.065,1.27; INT 14.605,19.05; PS0 9.525,19.05; PS1 12.065,19.05; RST 19.685,1.27; SCL 17.145,1.27; SDA 14.605,1.27; VIN 6.985,1.27
SOIC-18 = smd 2 x 0.6: 1 0,10.16; 2 0,8.89; 3 0,7.62; 4 0,6.35; 5 0,5.08; 6 0,3.81; 7 0,2.54; 8 0,1.27; 9 0,0; 10 9.4,0; 11 9.4,1.27; 12 9.4,2.54; 13 9.4,3.81; 14 9.4,5.08; 15 9.4,6.35; 16 9.4,7.62; 17 9.4,8.89; 18 9.4,10.16
DISCRETECOMPONENTS_SW_2512 = smd 2.5 x 1.6: 1 -3,0; 2 3,0
SOIC-16 = smd 2.2 x 0.7: 1 -4.6,4.445; 2 -4.6,3.175; 3 -4.6,1.905; 4 -4.6,0.635; 5 -4.6,-0.635; 6 -4.6,-1.905; 7 -4.6,-3.175; 8 -4.6,-4.445; 9 4.6,-4.445; 10 4.6,-3.175; 11 4.6,-1.905; 12 4.6,-0.635; 13 4.6,0.635; 14 4.6,1.905; 15 4.6,3.175; 16 4.6,4.445
IPL7X2 = drill 1.016 pad 1.524: 1 2.032,3.81; 2 2.032,1.27; 3 4.572,3.81; 4 4.572,1.27; 5 7.112,3.81; 6 7.112,1.27; 7 9.652,3.81; 8 9.652,1.27; 9 12.192,3.81; 10 12.192,1.27; 11 14.732,3.81; 12 14.732,1.27; 13 17.272,3.81; 14 17.272,1.27; 15 19.812,3.81; 16 19.812,1.27
XTAL_ECS-80-S-4X = drill 0.63 pad 1.03: 1 -2.44,0; 2 2.44,0

### Placement (x,y rotation side)
3V  67.51,70.46 270 top
5V  7.09,45.31 270 top
C1  31.65,61.87 180 bottom
C2  25.78,62.1 0 bottom
C4  17.93,34.65 90 top
C7  45.57,37.31 270 bottom
C10  16.61,11.35 90 top
C11  16.54,7.52 90 top
C12  19.58,17.83 0 bottom
C13  19.48,23.8 180 bottom
C14  4.57,14.1 90 top
J3  60.53,49.43 180 top
J5  52.22,49.48 180 top
J6  44.48,49.56 180 top
J7  3.71,26.59 270 top
J9  4.62,36.32 270 top
J10  67.34,66.98 270 top
J11  66.55,42.6 90 top
J12  33.99,58.17 270 top
J13  21.77,29.82 0 top
J14  41.07,55.65 180 top
J15  62.43,45.21 270 top
OVERCURRENT  29.18,19.53 270 top
Q2  26.37,16 90 bottom
Q3  38,11.71 0 bottom
Q4  42.57,17.65 270 bottom
Q5  42.47,13.82 270 bottom
R1  30.15,58.7 90 top
R2  27,58.32 90 top
R8  20.57,40.08 90 top
R9  17.78,40.03 270 bottom
R10  47.68,28.14 0 bottom
R11  47.37,34.01 0 bottom
R12  45.77,30.99 180 bottom
R13  16.38,3.15 180 top
R14  16.36,4.8 180 top
R15  4.55,45.31 270 bottom
R16  63.37,71.32 180 top
R17  31.01,7.54 270 top
R18  26.47,19 180 bottom
R19  22.76,16 90 bottom
R20  22.38,6.35 90 bottom
R21  24.79,8.13 270 bottom
R22  45.14,10.74 180 bottom
R23  37.16,19.74 90 bottom
R24  46.94,18.52 180 bottom
R25  47.02,14.73 180 bottom
R26  37.26,15.85 270 bottom
R27  30.15,40.94 90 top
R28  28.17,40.89 90 top
R29  26.09,40.84 90 top
R30  23.34,41.83 90 top
U2  20.75,20.65 180 bottom
U$3  34.95,47.45 270 top
U$4  65.35,4.17 90 top
U$5  40.59,46.84 270 top
U$6  20.42,55.07 270 top
U$7  34.24,5.54 90 top
U$8  23.98,7.34 180 top
U$9  58.32,9.02 180 top
Y2  29.06,64.59 180 top

### Tracks (layer width: path | path; a pad name or v marks a point on that pad's centre or on a via)
3V3  (via drill 0.35, 0.55, 0.85)
  Top 0.508: 39.37,47.35 39.37,49.45 38.53,50.29 J14.2 37.36,55.65 36.88,56.13 36.88,58.19 35.51,59.56 32.97,59.56 32.54,59.13 32.54,57.48 32.05,57 31.37,57 30.58,56.21 U$6.1 30.58,54.25 27.79,51.46 v23.52,51.46 | 39.37,47.35 v39.37,43.03 | v47.75,43.18 45.8,41.22 v45.8,41.2 | J3.1 58.65,52.19 58.04,52.81 51.31,52.81 50.35,51.85 J5.1 | v22.35,56.67 22.94,57.25 23.82,57.25 24.28,56.79 24.28,55.12 U$6.6 | v59.26,46.94 63.32,46.94 63.58,46.69 v64.9,46.69 | J6.1 41.96,49.56 41.25,48.84 41.25,47.63 40.97,47.35 39.37,47.35 | 28.14,36.53 28.17,36.55 v30.63,36.55
  Top 0.61: v28.14,34.26 28.14,36.53 28.14,40.02 R28.1
  Top 0.762: R16.2 62.52,68.92 64.63,66.81 64.63,55.11 66.6,53.14 66.6,50.27 J11.4 | J15.2 64.19,42.67 64.9,43.38 v64.9,46.69
  Bottom 0.508: v30.63,36.55 34.21,36.55 37.52,39.85 | U$3.VIN 39.37,41.71 v39.37,43.03 | v45.8,41.2 44.18,39.58 44.15,39.58 | J5.1 50.35,44.94 49.63,44.22 48.79,44.22 v47.75,43.18 | v59.26,46.94 58.65,47.54 J3.1 | v23.52,51.46 22.58,51.46 22.35,51.69 v22.35,56.67
  Bottom 0.61: J13.3 26.85,33.22 27.89,34.26 v28.14,34.26
  Bottom 0.762: R25.1 45.99,14.55 R22.2 45.99,9.76 45.57,9.35 43.89,9.35 43.59,9.04 U$9.12 | R25.1 46.17,18.44 R24.1 | R24.1 46.09,22.34 46.83,23.08 R10.2 46.83,30.78 R12.2 46.62,33.91 R11.2 46.52,34.81 46.89,35.18 46.89,37.85 46.57,38.16 C7.1 44.15,39.58 43.88,39.85 U$5.VIN 37.52,39.85 U$3.VIN | v64.9,46.69 64.9,49.81 65.3,50.22 J11.4 | Q4.1 46,18.6 R24.1 | Q5.1 43.5,14.73 R25.1
5V  (via drill 0.35, 0.6, 0.7, 0.85, 0.9)
  Top 0.508: v38.86,6.45 33.58,6.45 31.64,8.39 R17.1 | v5.38,41.94 9.04,41.94 9.07,41.91 10.16,43 10.16,43.94 10.52,44.3 v18.67,44.3 | v21.03,43.23 21.69,43.89 U$6.11
  Top 0.762: v34.32,20.83 31.87,18.38 31.87,17.56 32.87,16.56 | 26.49,7.98 23.95,7.98 v22.45,9.47 21.41,10.52 U$8.10 19.37,10.5 17.83,10.5 | 26.49,7.98 U$8.5 | 26.49,7.98 26.49,4.62 23.6,1.73 17.09,1.73 | 17.09,1.73 2.23,1.73 1.47,2.49 1.47,43.49 v2.44,44.45 | J13.4 29.39,28.5 24.97,24.08 v24.97,23.09 | U$8.5 U$8.6 U$8.7 U$8.8 28.58,12.27 32.87,16.56 | 17.21,3.18 R14.1 | v33.3,15.01 33.3,16.13 32.87,16.56 | U$8.5 29.34,7.98 29.75,8.39 R17.1 | 17.09,1.73 17.23,1.87 R13.1 | C10.1 17.83,10.5 | v17.73,14.22 17.73,10.61 17.83,10.5
  Top 1.016: R13.1 17.21,3.18
  Bottom 0.152: 22.94,19.58 U2.8
  Bottom 0.508: U$9.8 48.67,6.76 48.36,6.45 v38.86,6.45 | C13.1 18.57,23.74 U2.4 19.99,21.64 21.97,19.66 U2.8 | 4.52,44.44 4.52,42.8 v5.38,41.94 | v18.67,44.3 19.1,44.3 20.17,43.23 v21.03,43.23
  Bottom 0.762: v33.3,15.01 33.31,15 R26.2 | Q2.2 25.26,16.85 R19.2 | R19.2 22.94,17.03 22.94,19.58 | v17.73,14.22 17.7,14.25 17.7,15.85 18.36,16.51 20.04,16.51 20.43,16.9 C12.1 21.28,17.83 21.64,17.48 21.64,17.37 22.16,16.85 R19.2 | R15.2 4.52,44.44 2.45,44.44 v2.44,44.45 | R20.2 21.76,7.2 21.34,7.62 21.34,8.36 v22.45,9.47 | v24.97,23.09 26.06,23.09 26.82,22.33 32.82,22.33 v34.32,20.83 34.95,20.19 35.66,20.19 36.07,20.6 37.15,20.6 R23.2
5V_RAW
  Top 0.762: R17.2 31,6.71 U$8.4 U$8.3 U$8.2 U$8.1
!AMP_FAULT  (via drill 0.35)
  Top 0.254: U$8.9 19.38,14.32 v20.14,15.09
  Bottom 0.254: Q2.1 24.03,15.05 22.86,15.05 R19.1 22.69,15.09 v20.14,15.09
!AMP_RESET  (via drill 0.35)
  Top 0.254: v33.65,10.44 33.65,11.71 v32.11,13.26 | v15.95,18.95 14.76,20.14 U$4.7 | v36.35,5.66 36.35,4.42 36.12,4.19 35.86,4.19 35.48,4.57 34.47,4.57 34.24,4.34 U$7.1
  Bottom 0.152: Q3.1 39.01,10.71 | 44.25,10.71 R22.1 | v15.95,18.95
  Bottom 0.254: 44.25,10.71 39.01,10.71 39.01,9.65 38.89,9.53 37.19,9.53 36.35,8.69 v36.35,5.66 34.34,5.66 34.09,5.92 34.09,7.72 33.65,8.15 v33.65,10.44 | v15.95,18.95 15.95,18.21 16.99,17.17 16.99,16.74 15.7,15.44 15.7,13.98 16.31,13.36 27.31,13.36 29.03,15.09 30.28,15.09 v32.11,13.26
A_INT  (via drill 0.35)
  Top 0.254: v43.89,43.84 45.49,45.44 50.95,45.44 54.97,41.43 54.97,35.51 54.2,34.75 U$3.AI1
  Bottom 0.254: v43.89,43.84 38.66,43.84 32.18,37.36 17.49,37.36 15.81,39.04 9.98,39.04 9.65,39.37 9.65,40.39 10.92,41.66 11.12,41.66 11.58,42.11 U$4.26
AIN2  (via drill 0.35)
  Top 0.254: v16.79,23.88 16.79,26.72 v16.74,26.77
  Bottom 0.254: v16.79,23.88 16.79,21.9 17.71,20.98 U2.3 | v16.74,26.77 16.74,28.17 17.07,28.5 22.12,28.5 22.73,27.89 23.29,27.89 24.31,28.91 J13.2
AMP_OUT  (via drill 0.35)
  Top 0.254: U$8.12 18.26,7.98 17.75,8.49 v17.75,9.2
  Bottom 0.254: v17.75,9.2 17.29,9.65 15.42,9.65 15.27,9.8 15.27,19.23 16.36,20.32 U2.2
CAN_H  (via drill 0.35)
  Top 0.254: v26.06,48.51 25.27,47.73 20.78,47.73 20.37,47.32 20.37,45.72 U$6.10 20.42,43.71 19.76,43.05 19.76,41.1 19.93,40.93 R8.2 | U$9.13 41.05,4.22 42.01,3.26 65.48,3.26 68.12,5.9 68.12,62.56 67.34,63.35 J10.2
  Bottom 0.254: v26.06,48.51 31.55,54 31.55,59.64 31.93,60.02 35.84,60.02 45.75,69.93 49.15,69.93 50.67,68.4 50.67,60.86 56.13,55.4 57.86,55.4 58.83,56.36 58.83,58.67 63.68,63.53 65.71,63.53 66.62,64.44 J10.2
CAN_L  (via drill 0.35)
  Top 0.152: 20.42,53.24 v20.47,53.19
  Top 0.254: 20.42,53.24 U$6.9 20.37,55.12 20.37,58.98 21.79,60.4 v22.78,60.4 | U$9.14 40.31,7.75 39.65,7.09 39.65,3.84 40.64,2.85 65.8,2.85 68.63,5.68 68.63,66.8 68.4,67.03 67.39,67.03 J10.1
  Bottom 0.254: v20.47,53.19 20.47,51.71 17.78,49.02 R9.1 | v22.78,60.4 22.81,60.43 35.24,60.43 45.75,70.94 55,70.94 57.84,68.1 60.35,68.1 61.44,69.19 63.91,69.19 66.07,67.03 66.07,66.98 J10.1
CAN_RESET
  Top 0.254: U$6.17 29.31,44.35 30.15,43.51 R27.2 32.17,41.8 32.54,41.43 32.54,38.15 32.92,37.77 32.92,34.94 31.61,33.63 30.12,33.63 29.64,33.15 29.64,32.72 28.7,31.78 27.81,31.78 27.56,32.03 18.29,32.03 16.56,30.3 U$4.15
CLK  (via drill 0.35)
  Top 0.254: v28.12,48.85 26.59,47.32 24.41,47.32 24.23,47.14 U$6.13 24.23,43.05 23.86,42.68 R30.2 23.18,42.52 v21.84,42.52 | U$4.23 15.42,40.46 17.45,42.49 v19.1,42.49
  Bottom 0.152: 21.82,42.49 v21.84,42.52
  Bottom 0.254: v19.1,42.49 21.82,42.49 | v28.12,48.85 32.05,52.78 32.05,55.14 32.56,55.65 33.96,55.65 J12.2
CS  (via drill 0.35)
  Top 0.152: 28.04,41.87 R28.2 | 33.93,47.96 J12.5 | 24.31,38.02 v24.33,38.05
  Top 0.254: 28.04,41.87 U$6.16 28.04,46.96 v28.88,47.8 | v30.3,49.15 31.34,49.15 32.54,47.96 33.93,47.96 | U$4.24 12.56,40.46 13.66,39.36 14.58,39.36 14.77,39.55 16.54,39.55 17.02,40.03 18.54,40.03 18.72,39.85 18.72,39.64 18.54,39.46 18.54,38.92 19.44,38.02 24.31,38.02 | v29.11,38.56 29.11,41.66 29.02,41.74 R28.2
  Bottom 0.152: 30.23,49.15 v30.3,49.15
  Bottom 0.254: v28.88,47.8 30.23,49.15 | v24.33,38.05 28.6,38.05 v29.11,38.56
GND  (via drill 0.35)
  Top 0.152: 67.5,69.6 3V.C
  Top 0.254: v62.81,58.37 62.81,58.98 59.33,62.46 v59.33,69.06 | v65.15,69.6 67.5,69.6 | C10.2 16.61,14.1 v16.54,14.17 16.23,14.17 15.72,13.67 13.31,13.67 v13.03,13.94 | C10.2 | v31.22,35.33 v31.22,35.34 32.08,36.2 32.08,36.88 31.85,37.11 31.85,39.98 31.74,40.1 R27.1 30.15,39.07 v30.2,39.01 | J13.1 22.28,29.82 24.03,28.06 v25.07,28.06 | v20.88,25.96 20.47,25.55 20.47,24.89 20.83,24.54 v21.77,24.54 | U$4.6 9.58,17.6 9.02,18.16 v8.64,18.16 | v7.92,14.83 7.92,14.05 7.47,13.59 5.08,13.59 4.57,14.1 C14.- | U$8.11 20.47,9.25 20.78,8.94 20.76,8.92 20.76,7.51 20.59,7.35 18.16,7.35 17.14,8.37 C11.2 15.82,8.37 15.65,8.55 15.65,12.01 15.85,12.22 C10.2 | v26.19,17.97 29.04,17.97 29.18,18.11 OVERCURRENT.C 29.99,18.66 30.67,17.97 v30.67,15.82 | J7.1 3.71,27.53 3.07,28.17 3.07,35.64 3.76,36.32 J9.1 | v26.11,33.68 25.78,33.35 v20.45,33.35 19.08,33.35 18.63,33.8 C4.1 17.46,33.8 17.04,33.38 16.18,33.38 15.75,33.81 15.75,35.87 15.54,36.07 15,36.07 14.58,36.49 13.66,36.49 12.56,35.38 U$4.20 | v26.11,35.28 26.11,39.97 R29.1 26.61,39.99 26.95,39.65 26.95,39.01 v26.72,38.79 | R30.1 23.34,39.97 v24.36,38.96 | U$6.8 21.69,58.62 v21.74,58.67 | v37.21,59.36 37.21,60.4 v35.74,61.87 | U$7.2 34.24,9.3 35.23,10.29 v35.23,10.72 35.23,11.3 34.16,12.37 v34.16,12.4 | v56.26,51.82 56.26,50.04 55.7,49.48 J5.4 | v16.99,19.53 16.99,21.01 17.55,21.56 17.55,22.33 18.08,22.86 v21.79,22.86 | v8.43,35.81 5.97,35.81 5.82,35.96 5.82,38.23 v5.57,38.48 | v3.53,41.38 3.53,47.35 4.7,48.51 9.96,48.51 10.41,48.06 11.56,48.06 U$4.30 | J6.4 v46.35,51.76
  Bottom 0.254: v59.33,69.06 59.87,69.6 v65.15,69.6 | v16.54,14.17 16.54,15.63 C12.2 17.78,17.83 16.99,18.62 v16.99,19.53 | v31.22,35.33 31.22,34.8 30.86,34.44 30.86,33.43 31.98,32.31 33.81,32.31 36.25,34.75 U$3.GND 41.83,34.75 U$5.GND 45.03,34.77 45.57,35.31 C7.2 | v20.45,33.35 20.45,30.1 20.73,29.82 J13.1 | v25.07,28.06 25.32,27.81 25.32,26.34 24.94,25.96 v20.89,25.96 v20.88,25.96 | v21.77,24.54 22,24.31 22,23.8 | 20.47,23.8 C13.2 | U$4.14 11.84,27.76 12.85,26.75 12.85,23.39 13.56,22.68 U$4.9 14.12,22 12.93,20.8 12.93,17.6 | v8.64,18.16 7.92,17.45 v7.92,14.83 | v13.03,13.94 13.03,14.45 12.8,14.68 12.8,15.32 13.28,15.8 13.28,16.38 12.93,16.74 12.93,17.6 | 20.47,23.8 20.35,23.67 20.35,22.63 21.72,21.26 21.72,20.73 22.12,20.32 U2.7 23.65,20.32 24.79,19.18 24.79,18.38 25.2,17.97 v26.19,17.97 | v21.79,22.86 22,23.06 22,23.8 | v26.11,35.28 v26.11,33.68 | v24.36,38.96 24.53,38.79 v26.72,38.79 28.41,38.79 28.84,39.22 29.38,39.22 29.58,39.01 v30.2,39.01 | v21.74,58.67 19.91,60.5 19.89,60.5 19.89,61.09 20.9,62.1 C2.2 | J12.1 36.02,58.17 v37.21,59.36 | v35.74,61.87 C1.2 | U$9.6 51.21,9.12 50.65,9.68 46.84,9.68 46.13,8.97 U$9.10 | v35.23,10.72 v35.24,10.71 Q3.2 | v34.16,12.4 30.73,15.82 v30.67,15.82 | U$4.30 12.12,48.08 12.78,47.42 12.78,43.54 13.31,43 U$4.25 | J3.4 62.4,54.2 | 62.4,54.2 62.4,55.01 62.81,55.42 v62.81,58.37 | 56.26,54.2 62.4,54.2 | 20.47,23.8 22,23.8 | U$4.20 8.86,35.38 v8.43,35.81 | v5.57,38.48 5.57,39.34 v3.53,41.38 | 12.93,17.6 U$4.6 | v46.35,51.76 46.35,53.31 47.24,54.2 56.26,54.2 | v56.26,51.82 56.26,54.2
  pour Top (isolate 0.203): -4.78,80.37 -4.78,-4.83 2.26,-11.86 76,-11.86 81.97,-5.89 81.97,74.83 69.82,86.97 1.83,86.97
  pour Bottom (isolate 0.203): -5.05,82.5 1.32,88.87 70.05,88.87 83.54,75.39 83.54,-6.15 76.43,-13.26 2.29,-13.26 -5.05,-5.92
GPIO1  (via drill 0.35)
  Top 0.254: v39.06,2.67 39.39,2.34 56,2.34 56.69,1.65 v57.63,1.65 v57.63,1.66
  Bottom 0.254: U$4.36 9.88,55.7 7.77,53.59 7.77,34.65 10.34,32.08 10.34,8.71 10.34,4.22 11.89,2.67 v39.06,2.67 | U$9.1 57.45,5.21 57.63,5.03 v57.63,1.66
GPIO2  (via drill 0.35)
  Top 0.254: U$9.3 52.98,5.21 52.58,5.61 52.58,26.75 53.52,27.69 55.57,27.69 56.9,29.01 56.9,43.59 56.41,44.07 v54.51,44.07 | v44.35,45.67 43.64,45.67 v42.8,44.83 | v32.08,33.17 30.25,31.34 v29.64,31.34 | v28.27,32.69 v19.46,32.69 | v18.67,31.06 16.56,28.96 12.42,28.96 11.58,29.79 U$4.16 | v34.21,34.67 34.21,35.03 35.15,35.97 35.15,36.86 34.34,37.67 34.34,39.01 33.78,39.57 33.78,44.98 34.57,45.77 v38.53,45.77
  Bottom 0.254: v54.51,44.07 53.24,44.07 51.56,42.39 47.61,42.39 47.09,42.91 47.09,42.92 v44.35,45.67 | v42.8,44.83 41.33,44.83 40.39,45.77 v38.53,45.77 | v34.21,34.67 34.21,33.35 34.04,33.17 v32.08,33.17 | v29.64,31.34 28.3,32.69 v28.27,32.69 | v18.67,31.06 18.67,32.39 19,32.72 19.43,32.72 v19.46,32.69
GPIO3  (via drill 0.35)
  Top 0.254: U$9.5 50.62,5.21 50.06,5.77 50.06,13.69 51,14.63 51,15.04 49.86,16.18 49.86,18.49 47.35,21.01 40.59,21.01 39.78,21.82 v39.78,21.92 | U$4.18 12.83,31.6 v16.48,31.6 | v19.3,29.95 20.45,28.8 20.45,28.14 21.18,27.41 v26.49,27.41 | v32.03,29.16 34.77,31.9 v34.77,31.95 | v39.12,28.4 39.5,28.4 39.78,28.12 v39.78,24.79
  Bottom 0.254: v16.48,31.6 18.14,29.95 v19.3,29.95 | v26.49,27.41 30.28,27.41 v32.03,29.16 | v34.77,31.95 36.27,30.45 36.27,29.16 37.04,28.4 v39.12,28.4 | v39.78,24.79 v39.78,21.92
GPIO4  (via drill 0.35)
  Top 0.254: v12.99,4.9 12.97,4.87 9.41,4.87 8.5,5.78 v8.5,6.24 | v2.44,38.07 5.36,41 9.63,41 10.24,40.39 10.24,38.76 11.07,37.92 U$4.22 | v36.35,3.53 37.41,3.53 37.79,3.15 37.79,1.35 37.92,1.22 47.85,1.22 v48.31,1.68
  Bottom 0.254: U$9.7 48.67,2.03 v48.31,1.68 | v36.35,3.53 23.03,3.53 22.57,3.07 14.82,3.07 v12.99,4.9 | v8.5,6.24 5.46,9.28 5.46,28.37 4.6,29.24 2.97,29.24 2.44,29.77 v2.44,38.07
GPIO5  (via drill 0.35)
  Top 0.254: U$4.38 6.22,58.24 v5.87,57.89
  Bottom 0.254: v5.87,57.89 5.87,47.08 6.52,46.42 6.52,45.88 6.22,45.58 6.22,9.6 9.22,6.6 9.22,5.94 8.43,5.16 8.43,4.17 11,1.6 45.67,1.6 46.13,2.06 U$9.9
GPIO6
  Bottom 0.254: U$4.40 11.51,60.86 8.43,60.86 7.01,59.44 7.01,22.38 9.93,19.46 9.93,4.05 11.72,2.26 11.73,2.26 11.99,2.01 43.46,2.01 43.59,2.13 U$9.11
IMU_INT  (via drill 0.35)
  Top 0.152: v30.53,23.75 30.56,23.77
  Top 0.254: 30.56,23.77 47.5,23.77 50.42,26.7 50.42,27.66 49.94,28.14 v49.94,29.29 | v23.95,23.83 23.98,23.85 23.98,26.39 23.62,26.75 21.06,26.75 20.04,27.76 U$4.13
  Bottom 0.152: 24.03,23.75 v23.95,23.83
  Bottom 0.254: v49.94,29.29 50.32,29.67 U$3.GI1 57.3,29.67 57.76,30.12 57.76,31.85 58.14,32.23 U$5.INT | v30.53,23.75 24.03,23.75
IMU_RESET
  Bottom 0.152: 41.83,27.13 U$5.RST
  Bottom 0.254: 41.83,27.13 U$3.RST 35.59,25.22 35.56,25.25 32.74,25.25 32.26,24.77 30.51,24.77 29.29,25.98 28.27,25.98 26.92,24.64 26.36,24.64 25.45,25.55 22.55,25.55 22.22,25.22 U$4.11
INT
  Top 0.254: U$4.37 16.2,58.24 17.96,56.49 17.96,53.65 22,49.61 26.7,49.61 27.1,49.2 27.33,49.2 27.76,49.63 28.42,49.63 30.58,47.47 U$6.18
MISO  (via drill 0.35)
  Top 0.254: v22.63,36.42 23.77,36.42 25.63,34.57 26.52,34.57 27.38,35.43 v27.38,43.23 26.85,43.23 26.77,43.31 U$6.15
  Bottom 0.254: v27.38,43.23 29.46,43.23 30.48,44.25 36.4,44.25 36.86,44.7 36.86,49.76 36.07,50.55 J12.4 | v22.63,36.42 22.58,36.47 16.05,36.47 15.67,36.86 15.67,37.41 15.16,37.92 U$4.21
MOSI  (via drill 0.35)
  Top 0.254: U$6.14 25.5,44.32 | v25.09,36.63 25.09,41.58 25.21,41.69 R29.2 26.09,44.25 26.01,44.32 25.5,44.32 | 25.5,44.32 v25.5,43.56
  Bottom 0.254: U$4.19 23.85,35.38 v25.09,36.63 | J12.3 36.55,53.09 37.74,51.89 37.74,43.64 34.87,40.77 24.74,40.77 24.41,41.1 24.41,42.32 24.94,42.85 25.17,42.85 25.5,43.18 v25.5,43.56
N$1  (via drill 0.35)
  Top 0.254: R1.2 30.15,60.66 v29.54,61.27
  Bottom 0.254: v29.54,61.27 30.54,61.27 30.8,61.52 C1.1 30.8,62.47 31.5,63.17 Y2.1
N$2  (via drill 0.35)
  Top 0.254: v28.42,61.26 28.42,59.66 27.93,59.17 27.61,59.17 R2.2
  Bottom 0.254: v28.42,61.26 28.42,61.85 28.17,62.1 C2.1 26.63,64.58 Y2.2
N$3  (via drill 0.35)
  Top 0.152: R8.1 20.53,39.19
  Top 0.254: 20.53,39.19 v19.2,39.19 | v18.34,38.05 18.36,38.02 18.36,37.08 17.93,36.65 C4.2
  Bottom 0.254: v18.34,38.05 18.01,38.05 17.78,38.28 R9.2 19.19,39.18 v19.2,39.19
N$7  (via drill 0.35)
  Top 0.254: v5.87,46.15 7.05,46.15 5V.A
  Bottom 0.152: v5.86,46.16 v5.87,46.15
  Bottom 0.254: R15.1 v5.86,46.16
N$8
  Bottom 0.152: 59.66,29.67 U$5.ADR
  Bottom 0.254: R10.1 50.51,26.16 58.7,26.16 59.66,27.13 59.66,29.67
N$9
  Top 0.152: 67.5,71.32 3V.A
  Top 0.254: R16.1 67.5,71.32
N$11
  Top 0.152: 19.34,6.67 U$8.13
  Top 0.254: C11.1 19.34,6.67
N$12
  Bottom 0.152: 27.51,16.05 Q2.3
  Bottom 0.254: R18.2 27.32,17.29 27.51,17.09 27.51,16.05
N$13  (via drill 0.35)
  Top 0.152: 29.15,20.45 OVERCURRENT.A
  Top 0.254: v26.24,20.45 29.15,20.45
  Bottom 0.254: R18.1 25.62,19.83 v26.24,20.45
N$14
  Bottom 0.254: R21.1 24.79,9.87 26.25,11.33 34.7,11.33 36.18,12.81 Q3.3
OCD  (via drill 0.35)
  Top 0.254: U$8.16 19.38,3.46 19.46,3.54 20.59,3.54 20.89,3.83 v22.4,3.83
  Bottom 0.152: v22.4,3.83 22.38,3.86
  Bottom 0.254: 22.38,3.86 R20.1 24.35,5.5 24.79,5.94 R21.2
OSC1
  Top 0.254: R2.1 27,56.61 28.04,55.56 U$6.3
OSC2
  Top 0.254: R1.1 30.15,56.94 29.31,56.1 U$6.2
PI_POWER
  Top 1.016: R13.2 15.51,3.18 R14.2
  Top 1.778: U$4.4 U$4.2 9.94,10.88 C14.+ 4.57,7.65 9.04,3.18 15.51,3.18
ROBOT_ARM  (via drill 0.35)
  Top 0.152: v40.61,9.65 40.59,9.68
  Top 0.254: 40.59,9.68 40.59,13.06 37.77,15.88 35.15,15.88 v33.27,17.75 | v31.19,19.89 v34.42,23.11 | v35.33,24.51 35.33,26.64 34.19,27.79 v34.19,27.99 | v9.75,34.14 9.22,34.67 9.22,36.6 8.69,37.14 8.69,40.06 v8.96,40.34
  Bottom 0.152: 40.61,9.58 v40.61,9.65 | 11.53,50.67 U$4.32
  Bottom 0.254: U$9.15 37.57,5.21 37.26,5.51 37.26,8.64 37.74,9.12 40.16,9.12 40.61,9.58 | v33.27,17.75 33.27,17.81 v31.19,19.89 | v34.42,23.11 35.33,24.03 v35.33,24.51 | 11.53,50.67 10.21,50.67 8.96,49.43 v8.96,40.34 | v9.75,34.14 16.31,34.14 17.02,34.85 21.77,34.85 22.48,34.14 23.82,34.14 25.68,35.99 28.3,35.99 30.33,33.96 30.33,31.85 v34.19,27.99
ROBOT_ARM_2  (via drill 0.35)
  Top 0.254: v16.54,46.99 17.2,46.33 v18.69,46.33 | v32.11,45.29 32.82,45.29 33.35,44.76 33.35,39.04 33.81,38.58 33.81,35.79 33.35,35.33 v33.35,31.5 | v35.56,27.79 35.56,27.13 38.1,24.59 v38.1,24.54 | v40.06,20.07 40.06,16.33 42.47,13.92 42.47,9.3 41.96,8.79 40.61,8.79 40.59,8.76 38.71,8.76 38.51,8.56 U$9.16
  Bottom 0.254: U$4.33 15.42,53.16 16.54,52.04 v16.54,46.99 | v18.69,46.33 19.74,45.29 v32.11,45.29 | v33.35,31.5 35.56,29.29 v35.56,27.79 | v38.1,24.54 38.1,22.02 v40.06,20.07
RX
  Top 0.254: U$4.10 9.75,22.68 9.22,23.22 9.22,30.48 7.34,32.36 5.46,32.36 4.62,33.2 J9.2
RX0_INT  (via drill 0.35)
  Top 0.254: U$4.35 v16.99,55.7 | v18.74,55.73 19.13,55.35 19.13,53.39 20.14,52.38 25.25,52.38 26.77,53.9 U$6.4
  Bottom 0.152: 18.67,55.7 18.72,55.75 v18.74,55.73
  Bottom 0.254: v16.99,55.7 18.67,55.7
RX1_INT  (via drill 0.35)
  Top 0.254: U$4.29 14.55,48.08 15.09,48.62 v24.13,48.62 | v24.18,53.21 25.12,53.21 25.5,53.59 U$6.5
  Bottom 0.254: v24.18,53.21 24.18,48.67 v24.13,48.62
SCL  (via drill 0.35)
  Top 0.152: 14.17,17.65 U$4.5 | 47.32,16.79 v47.35,16.82
  Top 0.254: 14.17,17.65 14.17,18.62 13.7,19.09 12.22,19.09 12.09,18.96 9.08,18.96 6.58,21.46 5.13,21.46 5.11,21.44 4.93,21.62 4.93,22.02 3.76,23.19 3.76,24 J7.2 | v45.26,29.49 48.13,29.49 48.35,29.27 v48.35,26.91 | U$4.5 14.12,16.61 14.38,16.36 15.72,16.36 21.56,22.2 26.06,22.2 27.1,23.24 27.84,23.24 28.09,22.99 28.57,22.99 28.96,23.37 28.96,25.12 36.04,32.21 U$3.SCL 37.49,32.69 37.9,33.1 39.06,33.1 39.57,33.6 39.57,41.05 41.78,43.26 41.78,45.34 42.93,46.48 43.46,46.48 43.85,46.87 J6.2 | v44.98,16.79 47.32,16.79
  Bottom 0.152: 44.92,30.91 R12.1 | 59.9,50.3 59.92,50.32 | Q4.2 43.66,16.79 | 47.81,18.49 R24.2
  Bottom 0.254: J11.2 64.39,45.14 63.04,46.48 60.02,46.48 59.92,46.59 59.92,47.21 59.9,47.22 J3.2 59.9,50.3 | v45.26,29.49 44.92,29.83 44.92,30.91 43.94,30.91 42.77,29.74 41.91,29.74 U$5.SCL 41.07,29.69 38.56,32.21 U$3.SCL | J6.2 43.85,50.61 44.35,51.11 50.88,51.11 51,50.98 51.61,50.98 | 43.66,16.79 v44.98,16.79 | v47.35,16.82 47.79,17.26 R24.2 | v48.35,26.91 49.66,25.6 49.66,19.08 49.07,18.49 47.81,18.49 | 51.61,50.98 59.26,50.98 59.92,50.32 | J5.2 51.6,50.96 51.61,50.98
SCL_ADC
  Bottom 0.254: Q4.3 39.4,17.65 38.16,18.89 R23.1 34.48,18.89 31.72,21.64 U2.5
SDA  (via drill 0.35)
  Top 0.152: 41.81,32.28 U$5.SDA | 14.02,14.96 U$4.3 | 47.43,12.88 v47.44,12.87 | J6.3 45.13,49.53
  Top 0.254: 61.16,47.68 J11.3 | 41.81,32.28 40.82,32.28 38.2,29.67 U$3.SDA 35.97,29.67 35.38,30.25 35.08,30.25 29.82,24.99 29.82,23.37 30.02,23.17 v30.02,19.58 | 14.02,14.96 13.54,14.96 12.14,16.36 9.42,16.36 9.42,16.44 7.98,17.89 7.98,18.82 6.93,19.86 4.39,19.86 3.71,20.55 J7.3 | U$4.3 14.22,15.16 19.08,15.16 19.66,15.75 27.99,15.75 v29.72,17.48 | U$5.SDA 48.74,32.23 | 48.74,32.23 50.11,32.23 50.88,31.47 50.88,17.3 v50.83,17.25 | v44.65,12.88 47.43,12.88 | v48.74,32.89 48.74,32.23 | 61.16,47.68 52.86,47.68 | 61.16,47.68 61.15,47.69 J3.3 | J5.3 52.85,47.69 52.86,47.68 | J6.3 45.1,51.98 45.67,52.55 47.9,52.55 48.34,52.12 v48.34,48.44 | 45.13,49.53 45.13,47.91 45.36,47.68 52.86,47.68
  Bottom 0.152: 47.98,14.62 47.9,14.7 R25.2 | v44.64,12.87 v44.65,12.88
  Bottom 0.254: v47.44,12.87 47.98,13.41 47.98,14.62 | v50.83,17.25 50.83,15.65 49.88,14.7 47.9,14.7 | Q5.2 v44.64,12.87 | v29.72,17.48 30.84,18.59 30.84,18.82 30.07,19.58 v30.02,19.58 | v48.74,32.89 48.22,33.41 R11.1 48.22,40.65 41.98,46.9 41.98,48.07 42.35,48.44 44.15,48.44 v48.34,48.44
SDA_ADC
  Bottom 0.152: Q5.3 41.32,13.87
  Bottom 0.254: 41.32,13.87 40.46,13.87 39.55,14.78 39.55,15.85 38.7,16.7 R26.1 35.65,16.7 31.19,21.16 26.02,21.16 25.84,20.98 U2.6
TX
  Top 0.254: U$4.8 9.78,20.14 8.71,21.21 8.71,30.1 7.57,31.24 J9.3

### Text on the board
tPlace: X15 - Pi Shield / AJ Grama / Bryce Sasser / Rachel Livesay / Minh Nguyen / Katherine Sandys